# EAGLE design Schematic (EAGLE 9.6.2)

## Sheet 1 of 2
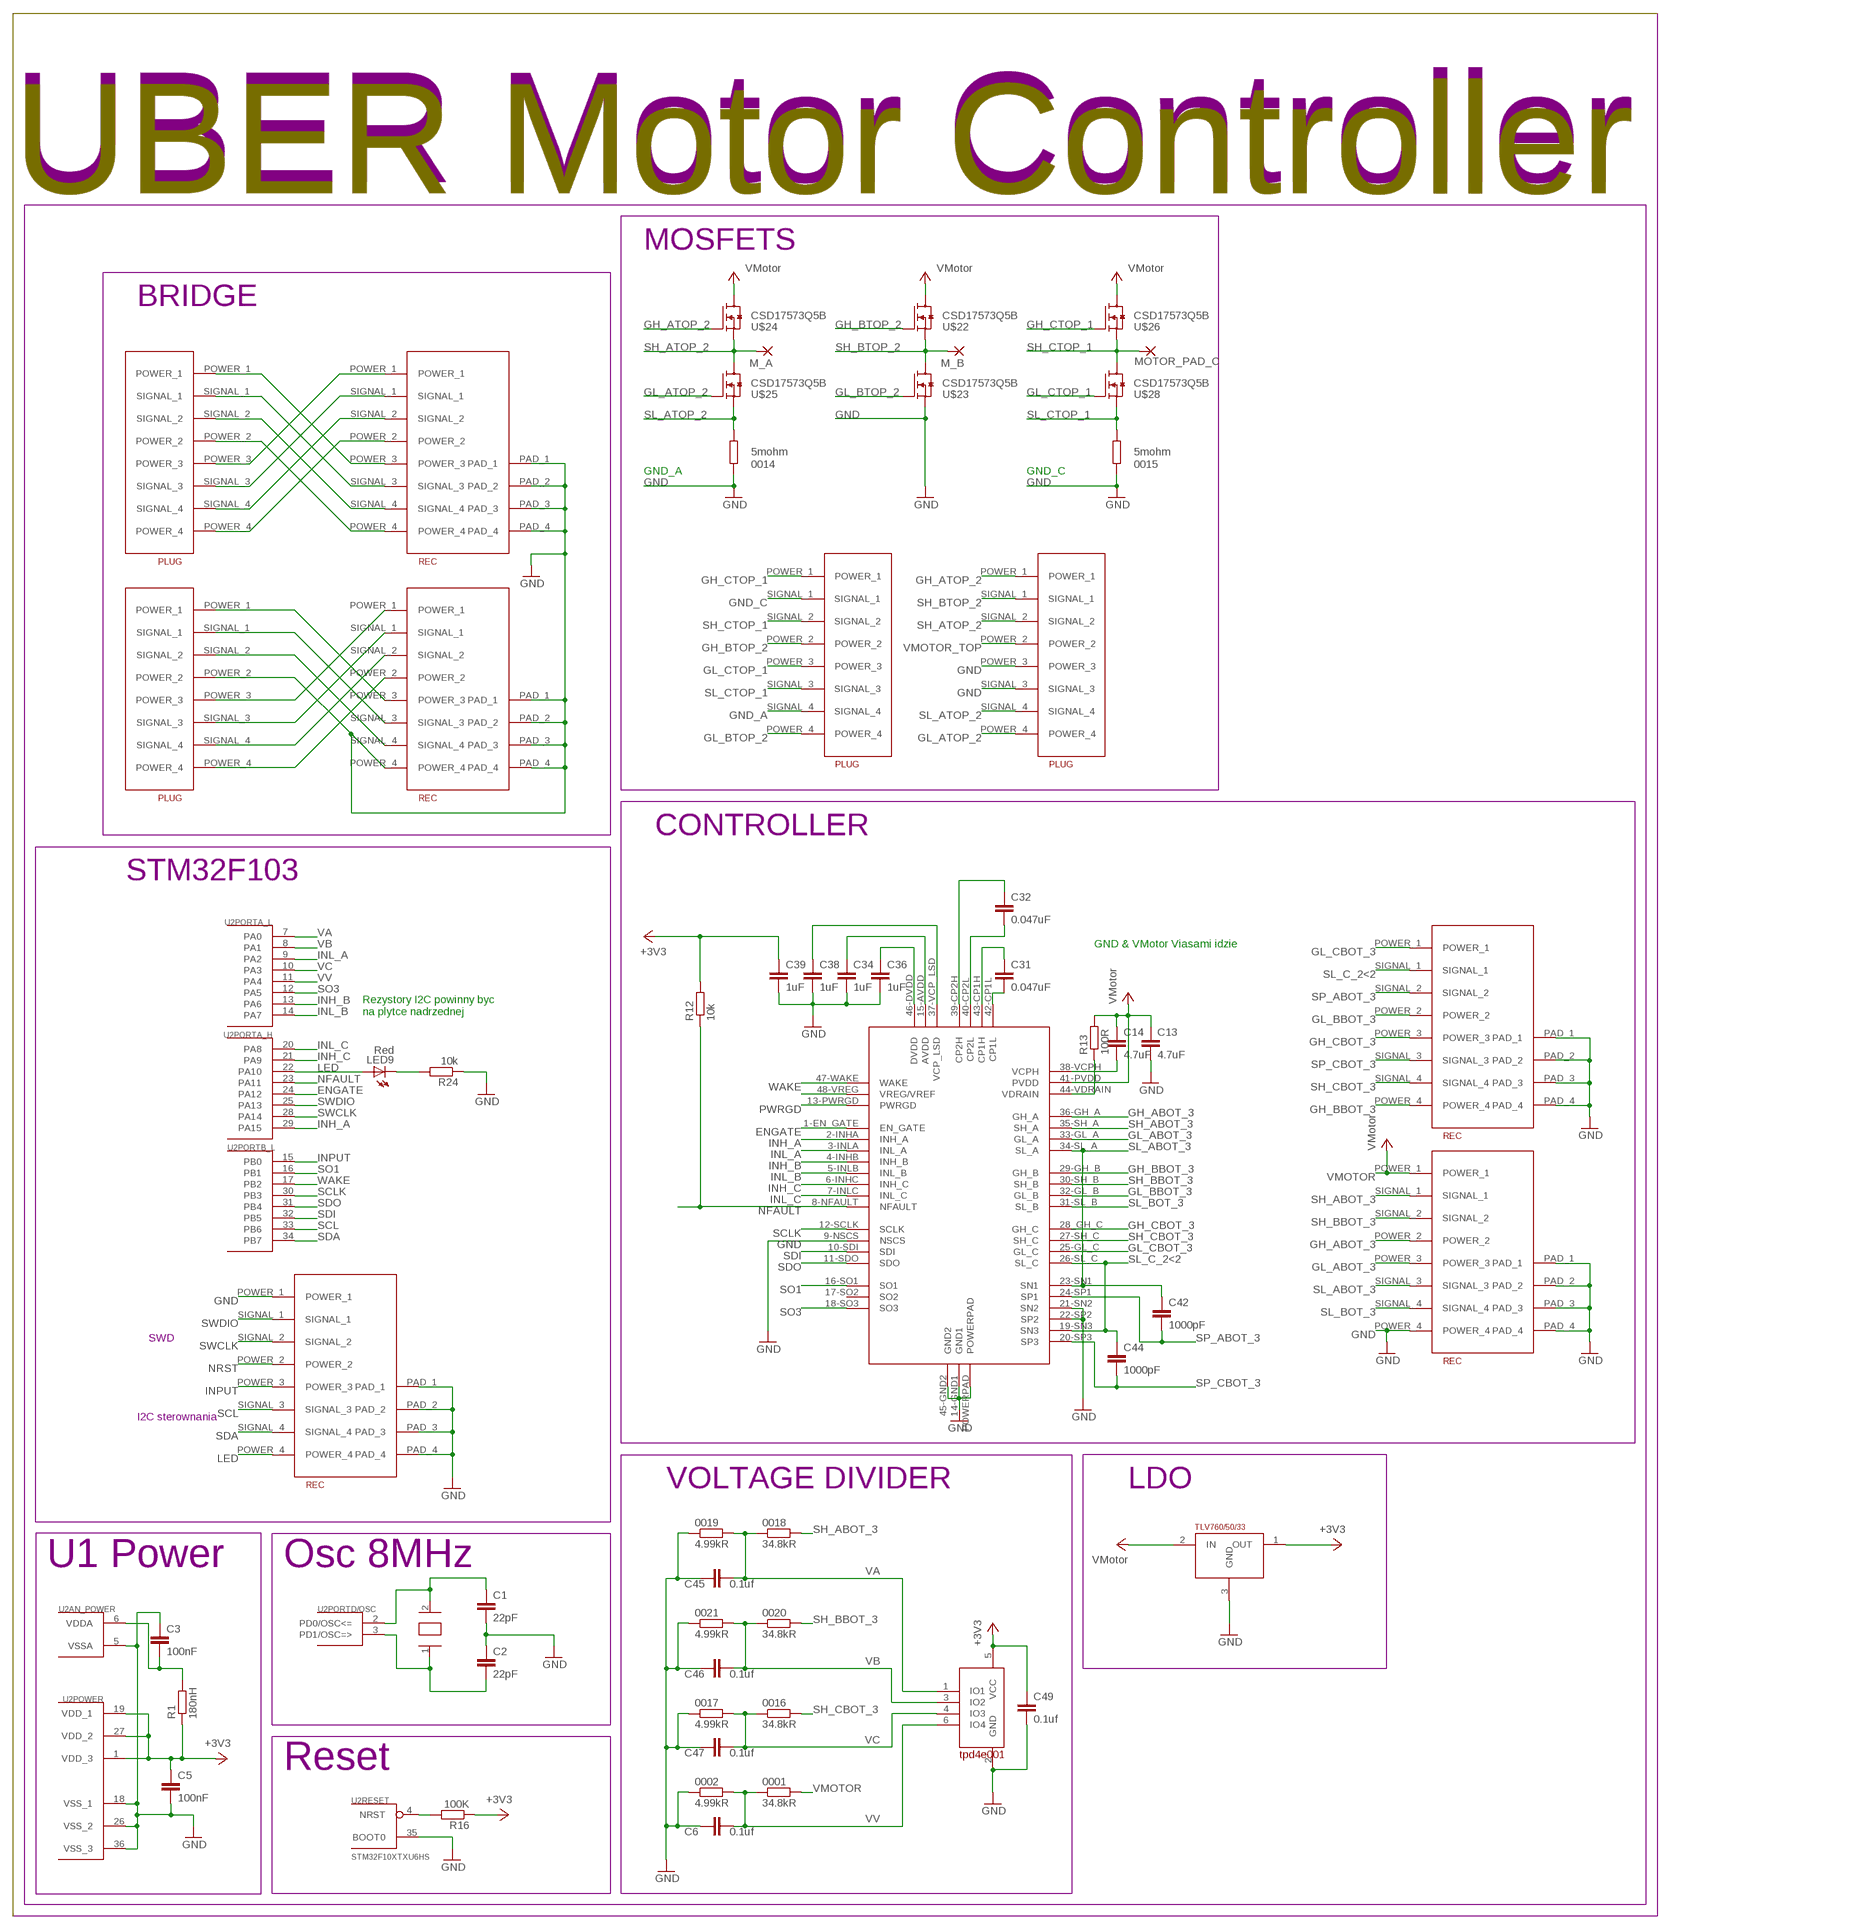
[diagram p0: schematic, sheet 1]

### Parts
0001  34.8kR  R-EU_R0603  [R0603]
0002  4.99kR  R-EU_R0603  [R0603]
0014  5mohm  R-EU_R2512  [R2512]
0015  5mohm  R-EU_R2512  [R2512]
0016  34.8kR  R-EU_R0603  [R0603]
0017  4.99kR  R-EU_R0603  [R0603]
0018  34.8kR  R-EU_R0603  [R0603]
0019  4.99kR  R-EU_R0603  [R0603]
0020  34.8kR  R-EU_R0603  [R0603]
0021  4.99kR  R-EU_R0603  [R0603]
C1  22pF  C-EUC0603  [C0603]
C2  22pF  C-EUC0603  [C0603]
C3  100nF  C-EUC0603  [C0603]
C5  100nF  C-EUC0603  [C0603]
C6  0.1uf  C-EUC0603  [C0603]
C13  4.7uF  C-EUC0805  [C0805]
C14  4.7uF  C-EUC0805  [C0805]
C31  0.047uF  C-EUC0603  [C0603]
C32  0.047uF  C-EUC0603  [C0603]
C34  1uF  C-EUC0603  [C0603]
C36  1uF  C-EUC0603  [C0603]
C38  1uF  C-EUC0603  [C0603]
C39  1uF  C-EUC0603  [C0603]
C42  1000pF  C-EUC0603  [C0603]
C44  1000pF  C-EUC0603  [C0603]
C45  0.1uf  C-EUC0603  [C0603]
C46  0.1uf  C-EUC0603  [C0603]
C47  0.1uf  C-EUC0603  [C0603]
C49  0.1uf  C-EUC0603  [C0603]
LED9  Red  LEDSML0603  [SML0603]
M_A  SMD5  [SMD2,54-5,08]
M_B  SMD5  [SMD2,54-5,08]
MOTOR_PAD_C  SMD5  [SMD2,54-5,08]
R1  180nH  R-EU_R0603  [R0603]
R12  10k  R-EU_R0603  [R0603]
R13  100R  R-EU_R0603  [R0603]
R16  100K  R-EU_R0603  [R0603]
R24  10k  R-EU_R0603  [R0603]
U2  STM32F10XTXU6HS  [VFQFPN36-HS]
U$1  MOLEG_REC_8X0.4MM  [REC]
U$2  MOLEG_REC_8X0.4MM  [REC]
U$3  MOLEX_PLUG_8X0.4MM  [PLUG]
U$4  MOLEG_REC_8X0.4MM  [REC]
U$5  MOLEG_REC_8X0.4MM  [REC]
U$6  MOLEX_PLUG_8X0.4MM  [PLUG]
U$7  MOLEX_PLUG_8X0.4MM  [PLUG]
U$8  MOLEX_PLUG_8X0.4MM  [PLUG]
U$9  MOLEG_REC_8X0.4MM  [REC]
U$10  OSC_8MHZ  [SMD_MINI]
U$11  TLV760XX  [SOT-23-3]
U$21  DRV8305  [S-PQFP-G48]
U$22  CSD17573Q5B  [Q5B]
U$23  CSD17573Q5B  [Q5B]
U$24  CSD17573Q5B  [Q5B]
U$25  CSD17573Q5B  [Q5B]
U$26  CSD17573Q5B  [Q5B]
U$28  CSD17573Q5B  [Q5B]
U$31  TPD4E001  [SOT-23]

### Nets
+3V3: C5.1 C39.1 C49.1 R1.1 R12.2 R16.1 U2.1(POWER:VDD_3) U2.19(POWER:VDD_1) U2.27(POWER:VDD_2) U$11.1(OUT) U$31.5(VCC)
ENGATE: U2.24(PORTA_H:PA12) U$21.1-EN_GATE(EN_GATE)
GH_ABOT_3: U$9.POWER_2 U$21.36-GH_A(GH_A)
GH_ATOP_2: U$3.POWER_1 U$24.G
GH_BBOT_3: U$4.POWER_4 U$21.29-GH_B(GH_B)
GH_BTOP_2: U$6.POWER_2 U$22.G
GH_CBOT_3: U$4.POWER_3 U$21.28_GH_C(GH_C)
GH_CTOP_1: U$6.POWER_1 U$26.G
GL_ABOT_3: U$9.POWER_3 U$21.33-GL_A(GL_A)
GL_ATOP_2: U$3.POWER_4 U$25.G
GL_BBOT_3: U$4.POWER_2 U$21.32-GL_B(GL_B)
GL_BTOP_2: U$6.POWER_4 U$23.G
GL_CBOT_3: U$4.POWER_1 U$21.25-GL_C(GL_C)
GL_CTOP_1: U$6.POWER_3 U$28.G
GND: 0002.1 0014.1 0015.1 0017.1 0019.1 0021.1 C1.2 C2.1 C3.1 C5.2 C6.2 C13.2 C34.2 C36.2 C38.2 C39.2 C45.2 C46.2 C47.2 C49.2 R24.1 U2.5(AN_POWER:VSSA) U2.18(POWER:VSS_1) U2.26(POWER:VSS_2) U2.35(RESET:BOOT0) U2.36(POWER:VSS_3) U$1.PAD_1 U$1.PAD_2 U$1.PAD_3 U$1.PAD_4 U$2.PAD_1 U$2.PAD_2 U$2.PAD_3 U$2.PAD_4 U$2.POWER_1 U$3.POWER_3 U$3.SIGNAL_3 U$4.PAD_1 U$4.PAD_2 U$4.PAD_3 U$4.PAD_4 U$5.PAD_1 U$5.PAD_2 U$5.PAD_3 U$5.PAD_4 U$5.POWER_4 U$8.POWER_2 U$9.PAD_1 U$9.PAD_2 U$9.PAD_3 U$9.PAD_4 U$9.POWER_4 U$11.3(GND) U$21.9-NSCS(NSCS) U$21.14-GND1(GND1) U$21.21-SN2(SN2) U$21.22-SP2(SP2) U$21.45-GND2(GND2) U$21.POWERPAD U$23.S1(S) U$23.S2(S) U$23.S3(S) U$31.2(GND)
GND_A: U$6.SIGNAL_4
GND_C: U$6.SIGNAL_1
INH_A: U2.29(PORTA_H:PA15) U$21.2-INHA(INH_A)
INH_B: U2.13(PORTA_L:PA6) U$21.4-INHB(INH_B)
INH_C: U2.21(PORTA_H:PA9) U$21.6-INHC(INH_C)
INL_A: U2.9(PORTA_L:PA2) U$21.3-INLA(INL_A)
INL_B: U2.14(PORTA_L:PA7) U$21.5-INLB(INL_B)
INL_C: U2.20(PORTA_H:PA8) U$21.7-INLC(INL_C)
INPUT: U2.15(PORTB_L:PB0) U$2.POWER_3
LED: LED9.A U2.22(PORTA_H:PA10) U$2.POWER_4
N$2: U$21.48-VREG(VREG/VREF)
N$3: U$5.POWER_3 U$8.POWER_1
N$4: U$5.SIGNAL_3 U$8.SIGNAL_1
N$5: U$5.SIGNAL_4 U$8.SIGNAL_2
N$7: U$1.POWER_3 U$7.POWER_1
N$8: U$1.SIGNAL_3 U$7.SIGNAL_1
N$9: U$1.SIGNAL_4 U$7.SIGNAL_2
N$10: C36.1 U$21.46-DVDD(DVDD)
N$11: U$1.POWER_4 U$7.POWER_2
N$12: C34.1 U$21.15-AVDD(AVDD)
N$13: C38.1 U$21.37-VCP_LSD(VCP_LSD)
N$14: C31.2 U$21.42-CP1L(CP1L)
N$15: U$5.POWER_1 U$8.POWER_3
N$16: C31.1 U$21.43-CP1H(CP1H)
N$17: U$5.SIGNAL_1 U$8.SIGNAL_3
N$18: U$5.SIGNAL_2 U$8.SIGNAL_4
N$19: U$5.POWER_2 U$8.POWER_4
N$20: C32.2 U$21.40-CP2L(CP2L)
N$21: C32.1 U$21.39-CP2H(CP2H)
N$22: R13.1 U$21.44-VDRAIN(VDRAIN)
N$23: C14.2 U$21.38-VCPH(VCPH)
N$24: C1.1 U2.2(PORTD/OSC:PD0/OSC<=) U$10.2
N$25: U$1.POWER_1 U$7.POWER_3
N$26: U$1.SIGNAL_1 U$7.SIGNAL_3
N$27: U$1.SIGNAL_2 U$7.SIGNAL_4
N$28: U$1.POWER_2 U$7.POWER_4
N$45: C3.2 R1.2 U2.6(AN_POWER:VDDA)
N$53: C2.2 U2.3(PORTD/OSC:PD1/OSC=>) U$10.1
N$81: LED9.C R24.2
NFAULT: R12.1 U2.23(PORTA_H:PA11) U$21.8-NFAULT(NFAULT)
NRST: R16.2 U2.4(RESET:NRST) U$2.POWER_2
PWRGD: U$21.13-PWRGD(PWRGD)
SCL: U2.33(PORTB_L:PB6) U$2.SIGNAL_3
SCLK: U2.30(PORTB_L:PB3) U$21.12-SCLK(SCLK)
SDA: U2.34(PORTB_L:PB7) U$2.SIGNAL_4
SDI: U2.32(PORTB_L:PB5) U$21.10-SDI(SDI)
SDO: U2.31(PORTB_L:PB4) U$21.11-SDO(SDO)
SH_ABOT_3: 0018.2 U$9.SIGNAL_1 U$21.35-SH_A(SH_A)
SH_ATOP_2: M_A.1(P) U$3.SIGNAL_2 U$24.S1(S) U$24.S2(S) U$24.S3(S) U$25.D1(D) U$25.D2(D) U$25.D3(D) U$25.D4(D) U$25.D5(D)
SH_BBOT_3: 0020.2 U$9.SIGNAL_2 U$21.30-SH_B(SH_B)
SH_BTOP_2: M_B.1(P) U$3.SIGNAL_1 U$22.S1(S) U$22.S2(S) U$22.S3(S) U$23.D1(D) U$23.D2(D) U$23.D3(D) U$23.D4(D) U$23.D5(D)
SH_CBOT_3: 0016.2 U$4.SIGNAL_4 U$21.27-SH_C(SH_C)
SH_CTOP_1: MOTOR_PAD_C.1(P) U$6.SIGNAL_2 U$26.S1(S) U$26.S2(S) U$26.S3(S) U$28.D1(D) U$28.D2(D) U$28.D3(D) U$28.D4(D) U$28.D5(D)
SL_ABOT_3: C42.1 U$9.SIGNAL_3 U$21.23-SN1(SN1) U$21.34-SL_A(SL_A)
SL_ATOP_2: 0014.2 U$3.SIGNAL_4 U$25.S1(S) U$25.S2(S) U$25.S3(S)
SL_BOT_3: U$9.SIGNAL_4 U$21.31-SL_B(SL_B)
SL_C_2<2: C44.1 U$4.SIGNAL_1 U$21.19-SN3(SN3) U$21.26-SL_C(SL_C)
SL_CTOP_1: 0015.2 U$6.SIGNAL_3 U$28.S1(S) U$28.S2(S) U$28.S3(S)
SO1: U2.16(PORTB_L:PB1) U$21.16-SO1(SO1)
SO3: U2.12(PORTA_L:PA5) U$21.18-SO3(SO3)
SP_ABOT_3: C42.2 U$4.SIGNAL_2 U$21.24-SP1(SP1)
SP_CBOT_3: C44.2 U$4.SIGNAL_3 U$21.20-SP3(SP3)
SWCLK: U2.28(PORTA_H:PA14) U$2.SIGNAL_2
SWDIO: U2.25(PORTA_H:PA13) U$2.SIGNAL_1
VA: 0018.1 0019.2 C45.1 U2.7(PORTA_L:PA0) U$31.1(IO1)
VB: 0020.1 0021.2 C46.1 U2.8(PORTA_L:PA1) U$31.3(IO2)
VC: 0016.1 0017.2 C47.1 U2.10(PORTA_L:PA3) U$31.4(IO3)
VMOTOR: 0001.2 C13.1 C14.1 R13.2 U$9.POWER_1 U$11.2(IN) U$21.41-PVDD(PVDD) ; supply symbol labelled VMotor
VMOTOR_TOP: U$3.POWER_2 U$22.D1(D) U$22.D2(D) U$22.D3(D) U$22.D4(D) U$22.D5(D) U$24.D1(D) U$24.D2(D) U$24.D3(D) U$24.D4(D) U$24.D5(D) U$26.D1(D) U$26.D2(D) U$26.D3(D) U$26.D4(D) U$26.D5(D) ; supply symbol labelled VMotor
VV: 0001.1 0002.2 C6.1 U2.11(PORTA_L:PA4) U$31.6(IO4)
WAKE: U2.17(PORTB_L:PB2) U$21.47-WAKE(WAKE)
Unconnected: U$21.17-SO2(SO2)

### Notes on the sheet
- UBER Motor Controller | UBER Motor Controller
- MOSFETS
- BRIDGE
- GND_A | GND_C
- CONTROLLER
- STM32F103
- GND & VMotor Viasami idzie
- Rezystory I2C powinny byc 
  na plytce nadrzednej
- SWD
- I2C sterownania
- VOLTAGE DIVIDER | LDO
- U1 Power | Osc 8MHz
- Reset

## Sheet 2 of 2
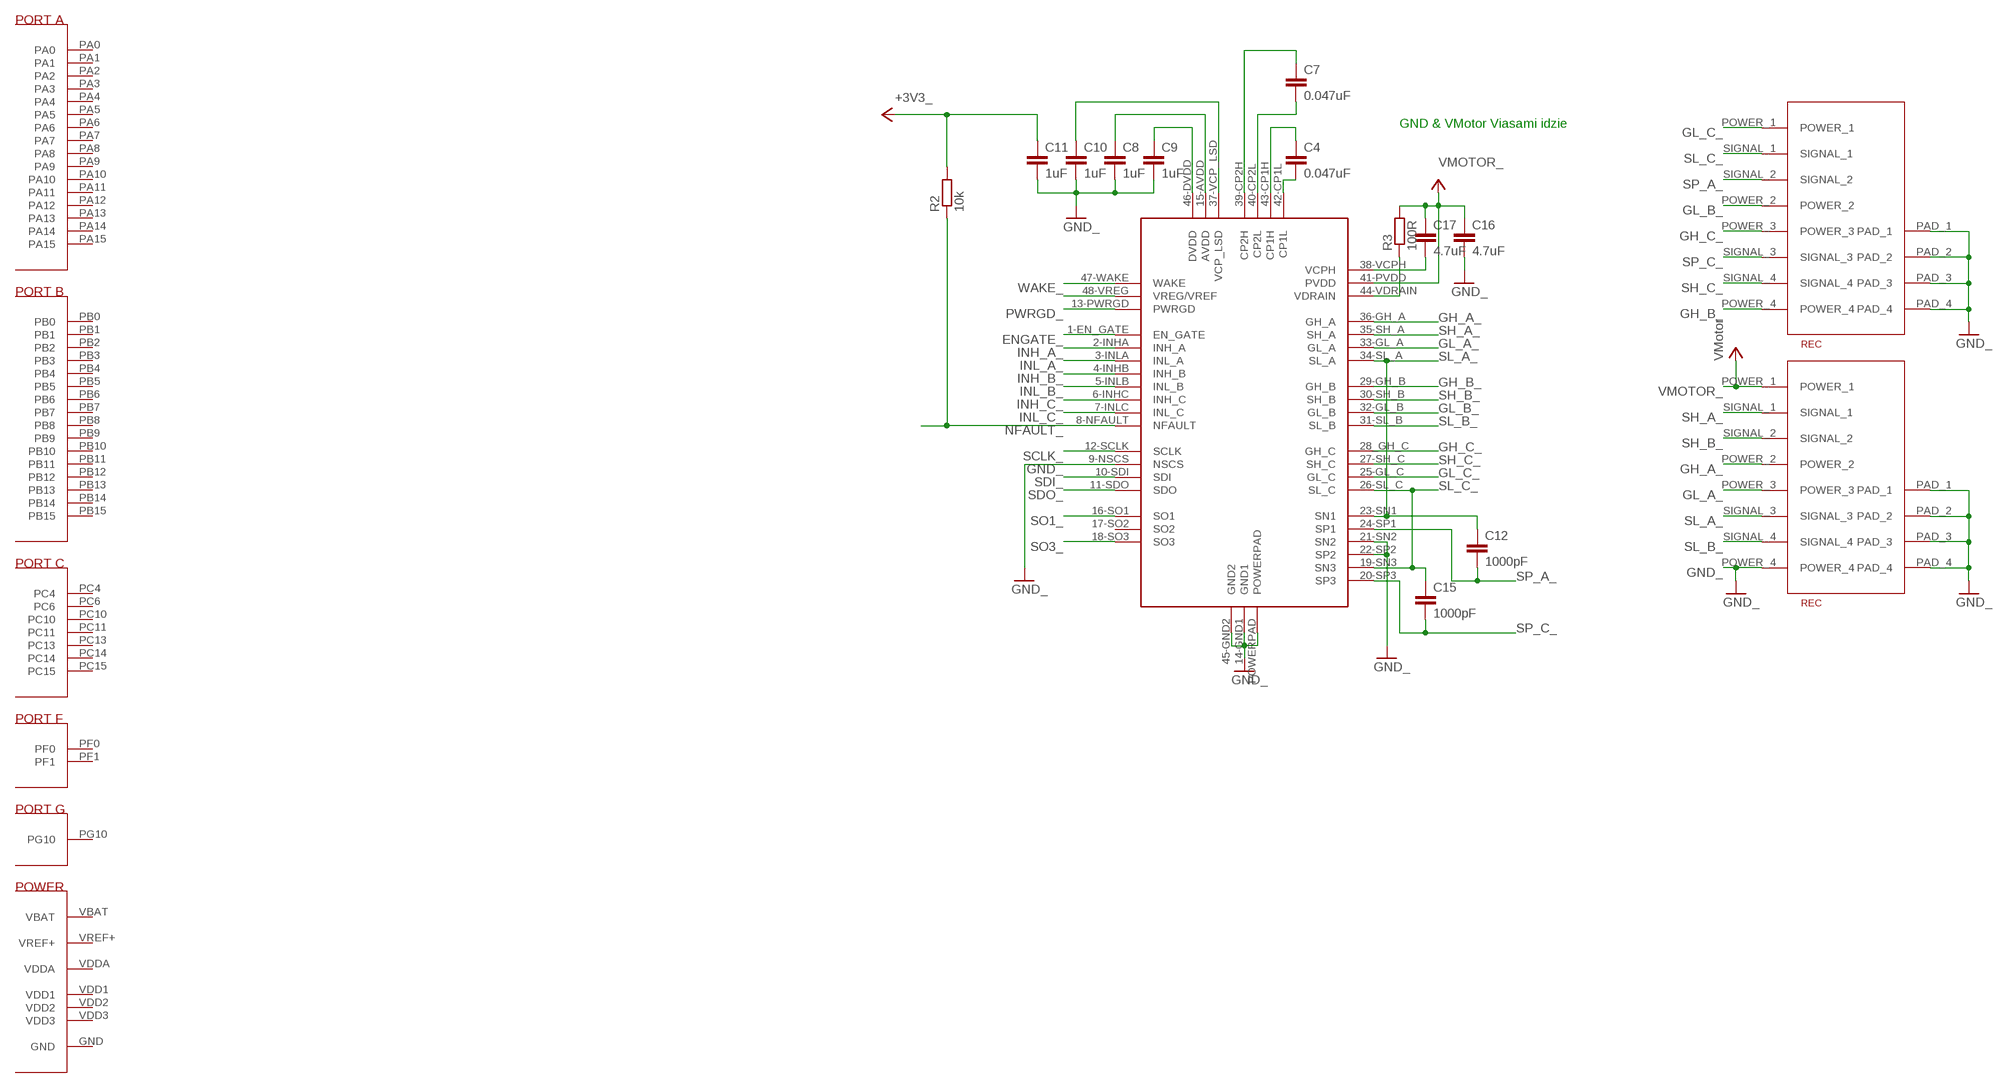
[diagram p1: schematic, sheet 2]

### Parts
C4  0.047uF  C-EUC0603  [C0603]
C7  0.047uF  C-EUC0603  [C0603]
C8  1uF  C-EUC0603  [C0603]
C9  1uF  C-EUC0603  [C0603]
C10  1uF  C-EUC0603  [C0603]
C11  1uF  C-EUC0603  [C0603]
C12  1000pF  C-EUC0603  [C0603]
C15  1000pF  C-EUC0603  [C0603]
C16  4.7uF  C-EUC0805  [C0805]
C17  4.7uF  C-EUC0805  [C0805]
R2  10k  R-EU_R0603  [R0603]
R3  100R  R-EU_R0603  [R0603]
U$12  STM32G473CC  [VFQFPN36]
U$13  DRV8305  [S-PQFP-G48]
U$14  MOLEG_REC_8X0.4MM  [REC]
U$15  MOLEG_REC_8X0.4MM  [REC]

### Nets
+3V3_: C11.1 R2.2 ; supply symbol labelled +3V3
ENGATE_: U$13.1-EN_GATE(EN_GATE)
GH_A_: U$13.36-GH_A(GH_A) U$15.POWER_2
GH_B_: U$13.29-GH_B(GH_B) U$14.POWER_4
GH_C_: U$13.28_GH_C(GH_C) U$14.POWER_3
GL_A_: U$13.33-GL_A(GL_A) U$15.POWER_3
GL_B_: U$13.32-GL_B(GL_B) U$14.POWER_2
GL_C_: U$13.25-GL_C(GL_C) U$14.POWER_1
GND_: C8.2 C9.2 C10.2 C11.2 C16.2 U$13.9-NSCS(NSCS) U$13.14-GND1(GND1) U$13.21-SN2(SN2) U$13.22-SP2(SP2) U$13.45-GND2(GND2) U$13.POWERPAD U$14.PAD_1 U$14.PAD_2 U$14.PAD_3 U$14.PAD_4 U$15.PAD_1 U$15.PAD_2 U$15.PAD_3 U$15.PAD_4 U$15.POWER_4 ; supply symbol labelled GND
INH_A_: U$13.2-INHA(INH_A)
INH_B_: U$13.4-INHB(INH_B)
INH_C_: U$13.6-INHC(INH_C)
INL_A_: U$13.3-INLA(INL_A)
INL_B_: U$13.5-INLB(INL_B)
INL_C_: U$13.7-INLC(INL_C)
N$30: C9.1 U$13.46-DVDD(DVDD)
N$31: C8.1 U$13.15-AVDD(AVDD)
N$32: C10.1 U$13.37-VCP_LSD(VCP_LSD)
N$33: C4.2 U$13.42-CP1L(CP1L)
N$34: C4.1 U$13.43-CP1H(CP1H)
N$35: C7.2 U$13.40-CP2L(CP2L)
N$36: C7.1 U$13.39-CP2H(CP2H)
N$38: R3.1 U$13.44-VDRAIN(VDRAIN)
N$39: C17.2 U$13.38-VCPH(VCPH)
N$40: U$13.48-VREG(VREG/VREF)
NFAULT_: R2.1 U$13.8-NFAULT(NFAULT)
PWRGD_: U$13.13-PWRGD(PWRGD)
SCLK_: U$13.12-SCLK(SCLK)
SDI_: U$13.10-SDI(SDI)
SDO_: U$13.11-SDO(SDO)
SH_A_: U$13.35-SH_A(SH_A) U$15.SIGNAL_1
SH_B_: U$13.30-SH_B(SH_B) U$15.SIGNAL_2
SH_C_: U$13.27-SH_C(SH_C) U$14.SIGNAL_4
SL_A_: C12.1 U$13.23-SN1(SN1) U$13.34-SL_A(SL_A) U$15.SIGNAL_3
SL_B_: U$13.31-SL_B(SL_B) U$15.SIGNAL_4
SL_C_: C15.1 U$13.19-SN3(SN3) U$13.26-SL_C(SL_C) U$14.SIGNAL_1
SO1_: U$13.16-SO1(SO1)
SO3_: U$13.18-SO3(SO3)
SP_A_: C12.2 U$13.24-SP1(SP1) U$14.SIGNAL_2
SP_C_: C15.2 U$13.20-SP3(SP3) U$14.SIGNAL_3
VMOTOR_: C16.1 C17.1 R3.2 U$13.41-PVDD(PVDD) U$15.POWER_1 ; supply symbol labelled VMotor
WAKE_: U$13.47-WAKE(WAKE)
Unconnected: U$12.GND U$12.PA0 U$12.PA1 U$12.PA2 U$12.PA3 U$12.PA4 U$12.PA5 U$12.PA6 U$12.PA7 U$12.PA8 U$12.PA9 U$12.PA10 U$12.PA11 U$12.PA12 U$12.PA13 U$12.PA14 U$12.PA15 U$12.PB0 U$12.PB1 U$12.PB2 U$12.PB3 U$12.PB4 U$12.PB5 U$12.PB6 U$12.PB7 U$12.PB8 U$12.PB9 U$12.PB10 U$12.PB11 U$12.PB12 U$12.PB13 U$12.PB14 U$12.PB15 U$12.PC4 U$12.PC6 U$12.PC10 U$12.PC11 U$12.PC13 U$12.PC14 U$12.PC15 U$12.PF0 U$12.PF1 U$12.PG10 U$12.VBAT U$12.VDD1 U$12.VDD2 U$12.VDD3 U$12.VDDA U$12.VREF+ U$13.17-SO2(SO2)

### Notes on the sheet
- GND & VMotor Viasami idzie

## Library data of the parts
0001 0002 0014-0021 R1-R3 R12 R13 R16 R24 = resistor:R-EU_: RESISTOR, European symbol
C1-C17 C31 C32 C34 C36 C38 C39 C42 C44-C47 C49 = rcl:C-EU: CAPACITOR, European symbol; SPICEPREFIX: C
LED9 = led:LED: LED OSRAM: - CHIPLED LG R971, LG N971, LY N971, LG Q971, LY Q971, LO R971, LY R971 LH N974, LH R974 LS Q976, LO Q976, LY Q976 LO Q996 - Hyper CHIPLED LW Q18S LB Q993, LB Q99A, LB R99A - SideLED LS A670, LO A670, LY A670, LG A670, LP A670 LB A673, LV A673, LT A673, LW A673 LH A674 LY A675 LS A676, LA A676, LO A676, LY A676, LW A676 LS A679, LY A679, LG A679 - Hyper Micro SIDELED® LS Y876, LA Y876, LO Y876, LY Y876 LT Y87S - SmartLED LW L88C, LW L88S LB L89C, LB L89S, LG L890 LS L89K, LO L89K, LY L89K LS L896, LA L896, LO L896, LY L896 - TOPLED LS T670, LO T670, LY T670, LG T670, LP T670 LSG T670, LSP T670, LSY T670, LOP T670, LYG T670 LG T671, LOG T671, LSG T671 LB T673, LV T673, LT T673, LW T673 LH T674 LS T676, LA T676, LO T676, LY T676, LB T676, LH T676, LSB T676, LW T676 LB T67C, LV T67C, LT T67C, LS T67K, LO T67K, LY T67K, LW E67C LS E67B, LA E67B, LO E67B, LY E67B, LB E67C, LV E67C, LT E67C LW T67C LS T679, LY T679, LG T679 LS T770, LO T770, LY T770, LG T770, LP T770 LB T773, LV T773, LT T773, LW T773 LH T774 LS E675, LA E675, LY E675, LS T675 LS T776, LA T776, LO T776, LY T776, LB T776 LHGB T686 LT T68C, LB T68C - Hyper Mini TOPLED® LB M676 - Mini TOPLED Santana® LG M470 LS M47K, LO M47K, LY M47K Source: http://www.osram.convergy.de LUXEON: - LUMILED® LXK2-PW12-R00, LXK2-PW12-S00, LXK2-PW14-U00, LXK2-PW14-V00 LXK2-PM12-R00, LXK2-PM12-S00, LXK2-PM14-U00 LXK2-PE12-Q00, LXK2-PE12-R00, LXK2-PE12-S00, LXK2-PE14-T00, LXK2-PE14-U00 LXK2-PB12-K00, LXK2-PB12-L00, LXK2-PB12-M00, LXK2-PB14-N00, LXK2-PB14-P00, LXK2-PB14-Q00 LXK2-PR12-L00, LXK2-PR12-M00, LXK2-PR14-Q00, LXK2-PR14-R00 LXK2-PD12-Q00, LXK2-PD12-R00, LXK2-PD12-S00 LXK2-PH12-R00, LXK2-PH12-S00 LXK2-PL12-P00, LXK2-PL12-Q00, LXK2-PL12-R00 Source: www.luxeon.com KINGBRIGHT: KA-3528ASYC Source: www.kingbright.com
M_A M_B MOTOR_PAD_C = wirepad:SMD5: SMD PAD
U2 = stm32:STM32F10XTXU6: STM32F101/103 36pad VFQPFN36
U$1 U$2 U$4 U$5 U$9 U$14 U$15 = MOLEX:MOLEG_REC_8X0.4MM
U$3 U$6-U$8 = MOLEX:MOLEX_PLUG_8X0.4MM
U$10 = OSC_8MHZ:OSC_8MHZ
U$11 = Zestaw:TLV760XX
U$12 = STM32G473CC:STM32G473CC
U$13 U$21 = drv8305lbr:DRV8305
U$22-U$26 U$28 = CSD_Mosfet:CSD17573Q5B
U$31 = tpd4e001:TPD4E001

## Board
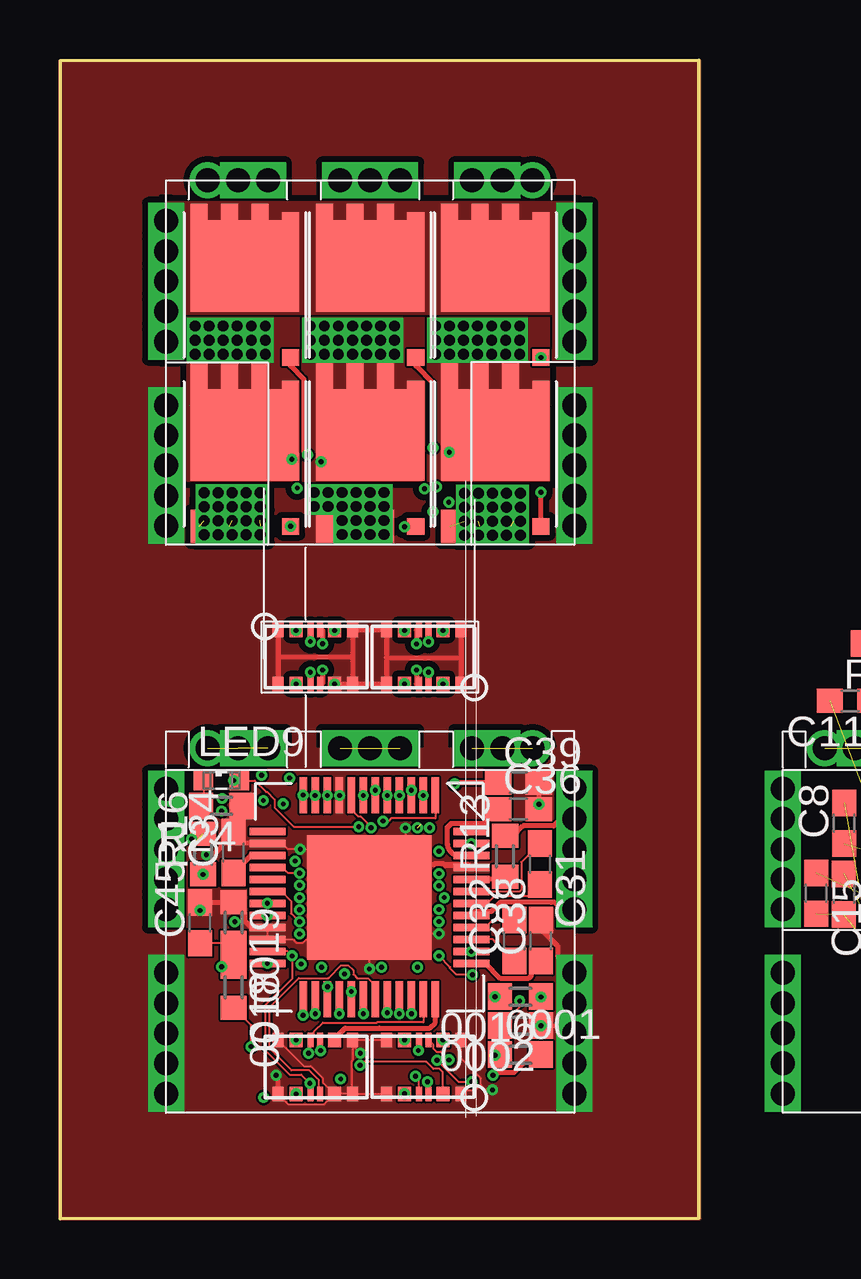
[diagram p2: board, top side]
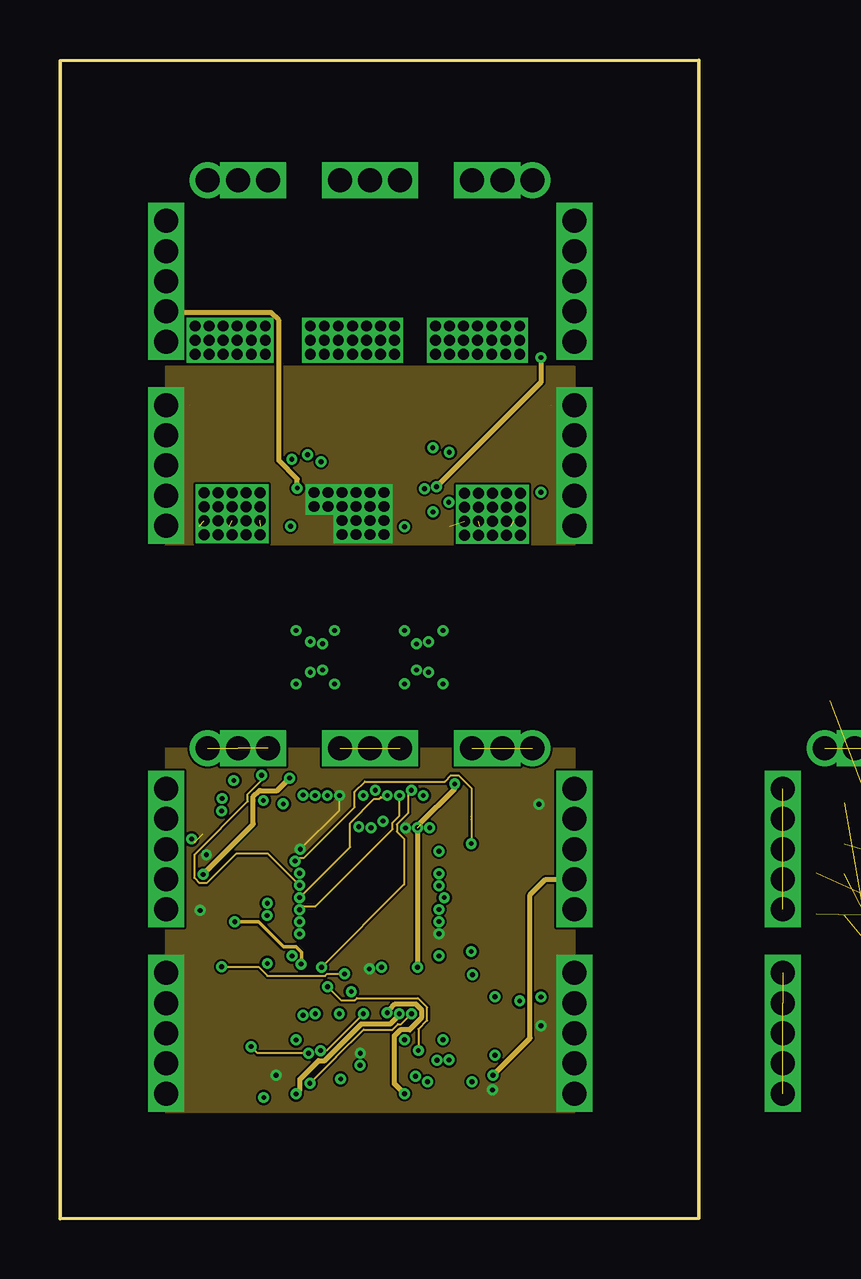
[diagram p3: board, inner layer Route2]
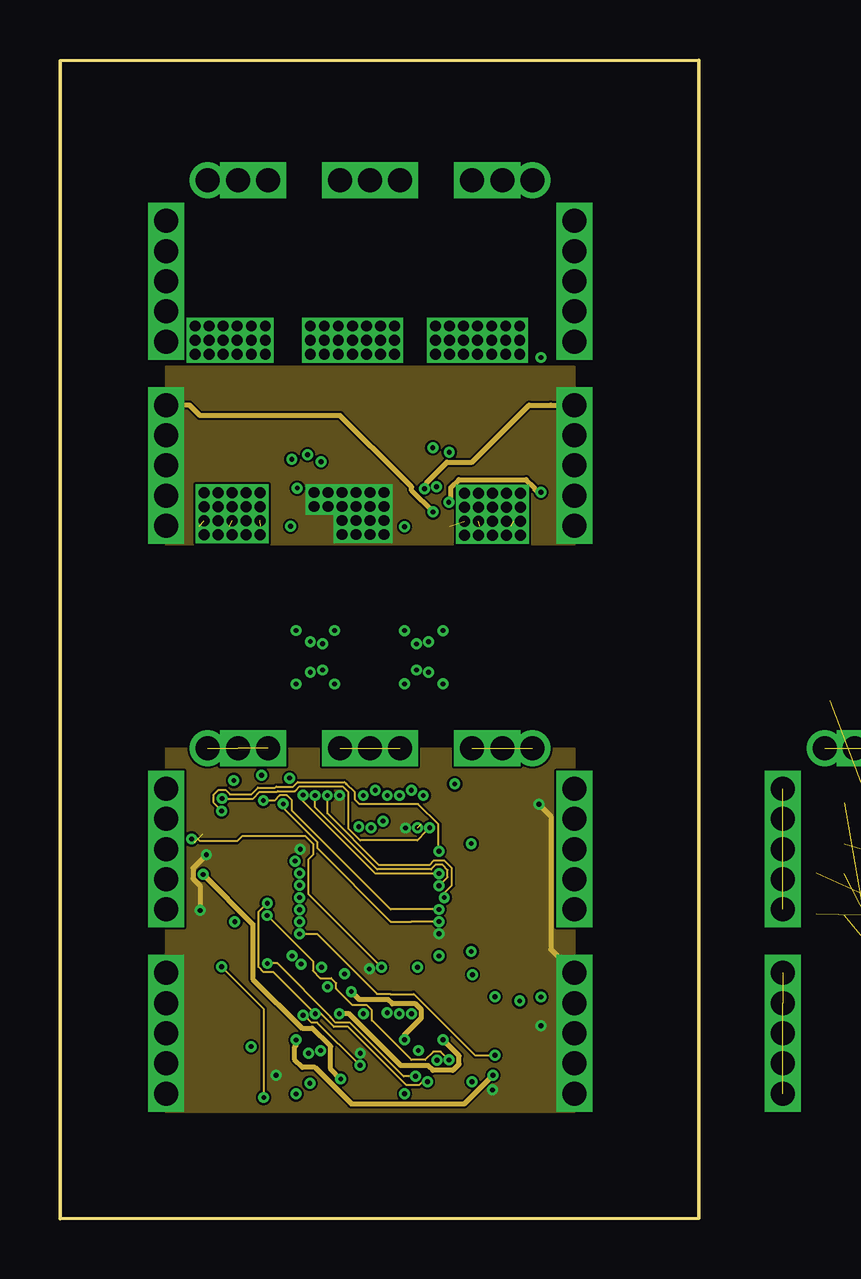
[diagram p4: board, inner layer Route15]
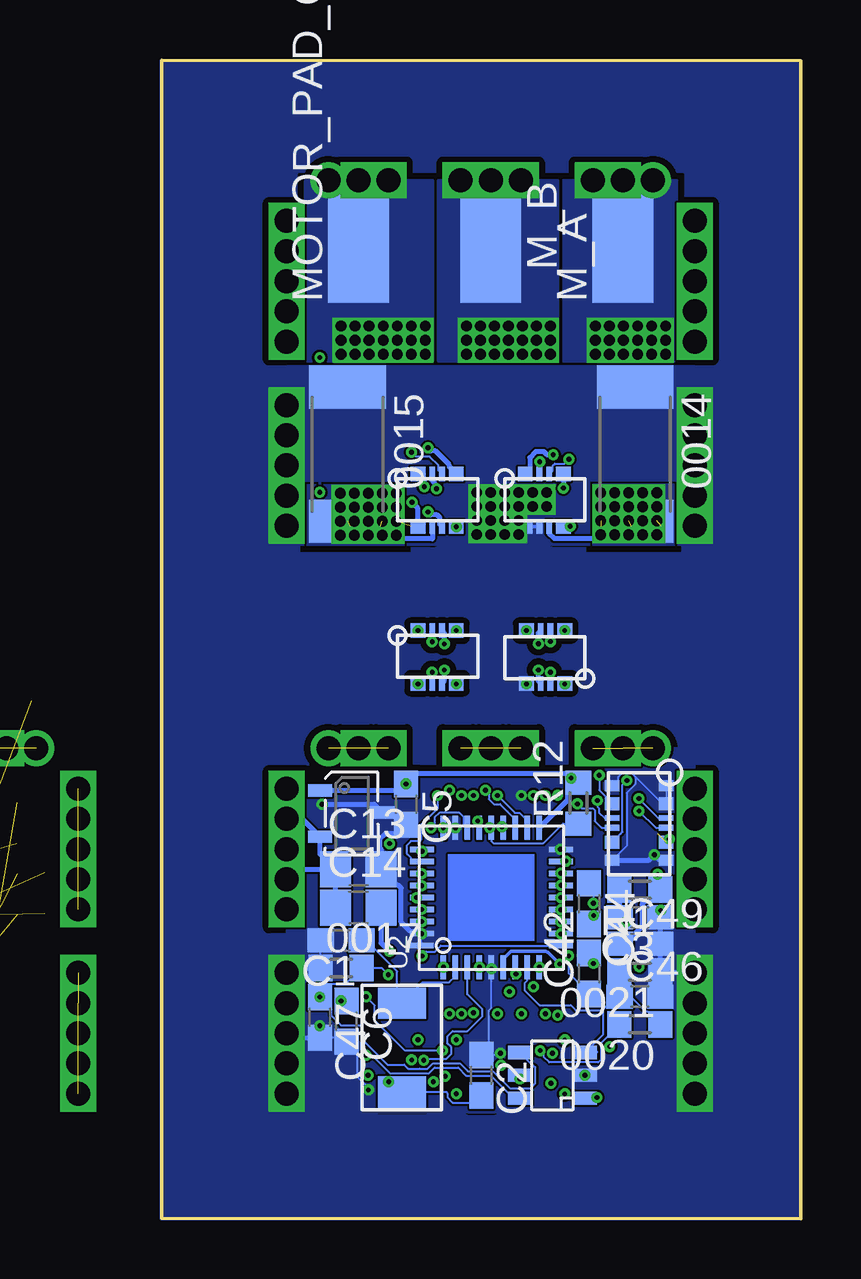
[diagram p5: board, bottom side, seen from below]

Size 26.64 x 48.29 mm. Coordinates in mm from the lower left corner, seen from the top.
Outline: 0,0 0,48.26 26.64,48.29 26.64,0.02 0,0
Copper layers (1*2*15*16): Top 0.035mm / dielectric 0.2mm / Route2 0.017mm / dielectric 0.2mm / Route15 0.017mm / dielectric 0.2mm / Bottom 0.035mm
Design rules "default *": minimum track width 3.5mil, minimum drill 0.3mm, track to track 3.5mil, track to pad 3.5mil, pad to pad 3.5mil, via to via 3.5mil, smd to smd 0mil, copper to edge 0mil, drill to drill 0mil, minimum pad ring 5mil, minimum via ring 5mil, stop-mask expansion 1mil, vias tented up to drill 0mil, thermal gap 0mil

### Footprints (pad centres in the part's own frame; a part is rotated, then mirrored left to right if it is on the bottom)
R0603 = smd 1 x 1.1: 1 -0.85,0; 2 0.85,0
R2512 = smd 1.8 x 3.2: 1 -2.8,0; 2 2.8,0
C0603 = smd 1.1 x 1: 1 -0.85,0; 2 0.85,0
C0805 = smd 1.3 x 1.5: 1 -0.95,0; 2 0.95,0
SML0603 = smd 0.8 x 0.8: A 0.75,0; C -0.75,0
SMD2,54-5,08 = smd 2.54 x 5.08: 1 0,0
VFQFPN36-HS = smd 1 x 0.23: 1 -2.9,2; 2 -2.9,1.5; 3 -2.9,1; 4 -2.9,0.5; 5 -2.9,0; 6 -2.9,-0.5; 7 -2.9,-1; 8 -2.9,-1.5; 9 -2.9,-2; 19 2.9,-2; 20 2.9,-1.5; 21 2.9,-1; 22 2.9,-0.5; 23 2.9,0; 24 2.9,0.5; 25 2.9,1; 26 2.9,1.5; 27 2.9,2 | smd 0.23 x 1: 10 -2,-2.9; 11 -1.5,-2.9; 12 -1,-2.9; 13 -0.5,-2.9; 14 0,-2.9; 15 0.5,-2.9; 16 1,-2.9; 17 1.5,-2.9; 18 2,-2.9; 28 2,2.9; 29 1.5,2.9; 30 1,2.9; 31 0.5,2.9; 32 0,2.9; 33 -0.5,2.9; 34 -1,2.9; 35 -1.5,2.9; 36 -2,2.905
REC = smd 0.45 x 0.6: PAD_1 -0.75,0; PAD_2 2.35,0; PAD_3 -0.75,-2.25; PAD_4 2.35,-2.25 | smd 0.55 x 0.6: POWER_1 0,0; POWER_2 1.6,0; POWER_3 0,-2.25; POWER_4 1.6,-2.25 | smd 0.24 x 0.6: SIGNAL_1 0.6,0; SIGNAL_2 1,0; SIGNAL_3 0.6,-2.25; SIGNAL_4 1,-2.25
PLUG = smd 0.62 x 0.6: POWER_1 0,0; POWER_2 1.6,0; POWER_3 0,-2.2; POWER_4 1.6,-2.2 | smd 0.24 x 0.6: SIGNAL_1 0.6,0; SIGNAL_2 1,0; SIGNAL_3 0.6,-2.2; SIGNAL_4 1,-2.2
SMD_MINI = smd 1.3 x 2: 1 -1.85,0; 2 1.85,0
SOT-23-3 = smd 0.508 x 1.016: 1 -0.941,-1.312; 2 0.986,-1.312; 3 -0.03,1.282
VFQFPN36 = smd 5.6 x 5.6: GND 0,0 | smd 0.55 x 0.3: PA0 -3.375,-0.775; PA1 -3.375,-1.275; PA2 -3.375,-1.775; PA3 -3.375,-2.275; PA4 -3.375,-2.775; PA8 3.375,-0.25; PA9 3.375,0.25; PA10 3.375,0.75; PA11 3.375,1.25; PA12 3.375,1.75; PA13 3.375,2.75; PB12 3.375,-2.75; PB13 3.375,-2.25; PB14 3.375,-1.75; PB15 3.375,-1.25; PC6 3.375,-0.75; PC13 -3.375,2.225; PC14 -3.375,1.725; PC15 -3.375,1.225; PF0 -3.375,0.725; PF1 -3.375,0.225; PG10 -3.375,-0.275; VBAT -3.375,2.725; VDD2 3.375,2.25 | smd 0.3 x 0.55: PA5 -2.75,-3.375; PA6 -2.25,-3.375; PA7 -1.75,-3.375; PA14 2.75,3.375; PA15 2.25,3.375; PB0 -0.75,-3.375; PB1 -0.25,-3.375; PB2 0.25,-3.375; PB3 0.75,3.375; PB4 0.25,3.375; PB5 -0.25,3.375; PB6 -0.75,3.375; PB7 -1.25,3.375; PB8 -1.75,3.375; PB9 -2.25,3.375; PB10 1.75,-3.375; PB11 2.75,-3.375; PC4 -1.25,-3.375; PC10 1.75,3.375; PC11 1.25,3.375; VDD1 -2.75,3.375; VDD3 2.25,-3.375; VDDA 1.25,-3.375; VREF+ 0.75,-3.375
S-PQFP-G48 = smd 0.3 x 1.5: 1-EN_GATE 0,0; 2-INHA 0.5,0; 3-INLA 1,0; 4-INHB 1.5,0; 5-INLB 2,0; 6-INHC 2.5,0; 7-INLC 3,0; 8-NFAULT 3.5,0; 9-NSCS 4,0; 10-SDI 4.5,0; 11-SDO 5,0; 12-SCLK 5.5,0; 25-GL_C 5.5,8.5; 26-SL_C 5,8.5; 27-SH_C 4.5,8.5; 28_GH_C 4,8.5; 29-GH_B 3.5,8.5; 30-SH_B 3,8.5; 31-SL_B 2.5,8.5; 32-GL_B 2,8.5; 33-GL_A 1.5,8.5; 34-SL_A 1,8.5; 35-SH_A 0.5,8.5; 36-GH_A 0,8.5 | smd 1.5 x 0.3: 13-PWRGD 7,1.5; 14-GND1 7,2; 15-AVDD 7,2.5; 16-SO1 7,3; 17-SO2 7,3.5; 18-SO3 7,4; 19-SN3 7,4.5; 20-SP3 7,5; 21-SN2 7,5.5; 22-SP2 7,6; 23-SN1 7,6.5; 24-SP1 7,7; 37-VCP_LSD -1.5,7; 38-VCPH -1.5,6.5; 39-CP2H -1.5,6; 40-CP2L -1.5,5.5; 41-PVDD -1.5,5; 42-CP1L -1.5,4.5; 43-CP1H -1.5,4; 44-VDRAIN -1.5,3.5; 45-GND2 -1.5,3; 46-DVDD -1.5,2.5; 47-WAKE -1.5,2; 48-VREG -1.5,1.5 | smd 5.17 x 5.17: POWERPAD 2.75,4.25
Q5B = smd 3.8 x 4.52: D1 0,-0.635 | smd 0.686 x 0.71: D2 -1.905,1.27; G 3.81,1.27 | smd 1.372 x 0.71: D3 -1.905,0; D4 -1.905,-1.27; D5 -1.905,-2.54; S1 3.81,0; S2 3.81,-1.27; S3 3.81,-2.54
SOT-23 = smd 0.55 x 1: 1 0,0; 2 0.95,0; 3 1.9,0; 4 1.9,2.7; 5 0.95,2.7; 6 0,2.7

### Placement (x,y rotation side)
0001  19.2,6.85 0 top
0002  19.2,8.05 180 top
0014  6.91,31.86 270 bottom
0015  18.9,31.86 270 bottom
0016  19.2,9.26 180 top
0017  19.16,10.45 0 bottom
0018  7.24,9.65 270 top
0019  7.24,12.34 270 top
0020  6.71,8.1 180 bottom
0021  6.71,10.3 180 bottom
C1  19.16,11.61 180 bottom
C2  13.32,5.98 270 bottom
C3  6.71,12.56 180 bottom
C4  44.2,16.46 270 top  (outside the outline)
C5  16.46,17.27 270 bottom
C6  18.95,8.23 270 bottom
C7  44.2,13.56 90 top  (outside the outline)
C8  32.69,16.48 90 top  (outside the outline)
C9  43.24,23.1 0 top  (outside the outline)
C10  49.24,10.17 270 top  (outside the outline)
C11  32.94,21.58 180 top  (outside the outline)
C12  32.68,13.53 270 top  (outside the outline)
C13  18.45,14.57 0 bottom
C14  18.45,12.97 0 bottom
C15  31.52,13.56 270 top  (outside the outline)
C16  45.54,16.93 90 top  (outside the outline)
C17  45.54,13.77 270 top  (outside the outline)
C31  20,14.78 270 top
C32  18.95,11.6 90 top
C34  7.24,15.27 90 top
C36  19.11,17.07 0 top
C38  20.05,11.6 90 top
C39  19.11,18.17 0 top
C42  8.83,10.22 90 bottom
C44  8.83,13.13 270 bottom
C45  5.84,12.33 90 top
C46  6.71,9.26 0 bottom
C47  20.05,8.39 270 bottom
C49  6.71,11.46 0 bottom
LED9  6.73,18.26 0 top
M_A  7.42,40.72 0 bottom
M_B  12.93,40.72 180 bottom
MOTOR_PAD_C  18.44,40.72 0 bottom
R1  6.71,13.72 180 bottom
R2  34.33,23.98 180 top  (outside the outline)
R3  48.98,21.01 90 top  (outside the outline)
R12  9.27,17.32 90 bottom
R13  18.55,15.11 90 top
R16  5.97,15.2 90 top
R24  6.73,17.21 180 top
U2  12.9,13.39 90 bottom
U$1  15.96,22.29 180 top
U$2  5.61,17.3 270 bottom
U$3  11.49,31.04 0 bottom
U$4  15.96,5.21 180 top
U$5  9.84,24.54 0 top
U$6  15.96,31.04 0 bottom
U$7  15.96,24.51 0 bottom
U$8  9.84,22.31 180 bottom
U$9  9.84,7.45 0 top
U$10  16.64,7.14 90 bottom
U$11  18.73,16.9 270 bottom
U$12  55.56,25.4 0 top  (outside the outline)
U$13  41.35,17.64 180 top  (outside the outline)
U$14  35.56,7.45 0 top  (outside the outline)
U$15  41.68,5.21 180 top  (outside the outline)
U$21  15.65,17.64 180 top
U$22  13.56,39.7 270 top
U$23  13.56,32.66 270 top
U$24  8.34,39.7 270 top
U$25  8.34,32.66 270 top
U$26  18.78,39.7 270 top
U$28  18.78,32.66 270 top
U$31  9,5.03 90 bottom

### Tracks (layer width: path | path; a pad name or v marks a point on that pad's centre or on a via)
+3V3  (via drill 0.2)  (1 unrouted)
  Top 0.203: C39.1 16.51,18.17 C5.1
  Route2 0.089: 15.05,16.44
  Route2 0.203: U2.1 v14.91,16.29 14.99,16.38 14.99,16.46 16.46,17.93 C5.1 | R16.1 8.06,16.45 8.06,17.6 8.31,17.85 8.35,17.85 9.06,17.85 v9.57,18.36
  Route15 0.203: v11.7,5.83 11.28,6.25 11.28,7.18 10.52,7.95 10.09,7.95 8.04,9.99 8.04,12.28 R16.1
  Bottom 0.089: U$31.5 v11.7,5.83 | U2.27 v14.91,16.29 | v14.91,16.29 | R1.1 5.86,14.24 R16.1
  Bottom 0.152: 10.86,16.29 U2.19
  Bottom 0.203: C5.1 16.32,18.26 16.32,18.27 | C5.1 16.52,18.07 | C5.1 16.46,18 | C5.1 16.74,17.84 U$11.1 | C5.1 16.01,18.57 9.68,18.57 9.54,18.43 9.53,18.43 R12.2 9.25,18.16 | U2.19 9.72,17.47 9.72,17.69 9.34,18.07 | 9.25,18.16 9.34,18.07 | R1.1 6.32,13.25 6.48,13.25 6.6,13.14 6.6,12.2 7.34,11.46 C49.1 | 8.98,18.48 8.98,18.43 9.25,18.16 | v9.57,18.36 9.57,18.3 9.34,18.07
  other vias: 14.9,10.49 16.46,18.12 5.97,14.35
+3V3_  (1 unrouted)
ENGATE  (via drill 0.2)
  Top 0.089: U$21.1-EN_GATE 15.65,16.69 13.8,16.69 13.69,16.57 v13.47,16.57
  Bottom 0.089: U2.24 | U2.24 13.4,16.5 v13.47,16.57
GH_A_  (1 unrouted)
GH_ABOT_3
  Top 0.203: U$9.POWER_2 11.44,7.5 11.89,7.95 13.31,7.95 15.41,7.95 15.65,8.18 U$21.36-GH_A
GH_ATOP_2  (via drill 0.2)
  Top 0.203: U$24.G 9.61,35.54 10.16,34.99 10.16,32 v10.32,31.83
  Bottom 0.203: v10.32,31.83 10.58,31.83 10.71,31.96 11.06,31.96 11.3,31.72 11.3,31.23 U$3.POWER_1
GH_B_  (1 unrouted)
GH_BBOT_3  (via drill 0.2)
  Top 0.203: v12.15,9.47 U$21.29-GH_B
  Route15 0.203: U$4.POWER_4 14.36,7.66 15.07,8.37 15.07,8.72 14.83,8.96 13.86,8.96 13.68,9.14 12.48,9.14 v12.15,9.47
  other vias: 14.36,7.46
GH_BTOP_2  (via drill 0.2)
  Top 0.203: U$22.G 14.83,35.54 15.54,34.83 v15.54,32.12
  Bottom 0.203: v15.54,32.12 15.42,32 15.23,32 14.65,31.42 14.65,31.33 U$6.POWER_2
GH_C_  (1 unrouted)
GH_CBOT_3  (via drill 0.2)
  Top 0.203: U$21.28_GH_C v11.65,8.54 | v11.65,8.54
  Route15 0.203: v11.65,8.54 12.06,8.54 14.21,6.39 15.35,6.39 15.54,6.19 16.38,6.19 16.64,6.45 16.64,6.79 15.98,7.46 U$4.POWER_3
  other vias: 15.96,7.46
GH_CTOP_1  (via drill 0.2)
  Route2 0.203: U$26.G 20.05,34.86 v15.7,30.51
  Bottom 0.203: v15.7,30.51 15.7,30.77 U$6.POWER_1
  other vias: 20.05,35.89
GL_A_  (1 unrouted)
GL_ABOT_3  (via drill 0.2)
  Top 0.203: U$21.33-GL_A v14.15,8.54
  Route2 0.203: 14.15,8.5 v14.15,8.54 14.06,8.46 14.06,8.41 13.78,8.12 12.56,8.12 11.28,6.84 11.04,6.59 10.77,6.59 10,5.82 10,5.37 U$9.POWER_3
  other vias: 9.84,5.2
GL_ATOP_2  (via drill 0.2)
  Bottom 0.203: U$3.POWER_4 9.88,28.85 U$25.G
  other vias: 9.61,28.85
GL_B_  (1 unrouted)
GL_BBOT_3  (via drill 0.2)
  Top 0.203: U$21.32-GL_B v13.65,8.59 v13.64,8.58
  Route2 0.203: v13.64,8.58 13.73,8.67 13.73,8.72 13.97,8.96 14.83,8.96 15.07,8.72 15.07,8.37 14.57,7.87 14.19,7.87 13.95,7.63 13.95,5.62 U$4.POWER_2
  other vias: 14.36,5.21
GL_BTOP_2  (via drill 0.2)
  Top 0.203: U$6.POWER_4 14.38,28.85 U$23.G
  other vias: 14.36,28.84
GL_C_  (1 unrouted)
GL_CBOT_3  (via drill 0.2)
  Top 0.089: U$21.25-GL_C 10.13,9.12 10.14,9.12 v10.14,8.48 | U$4.POWER_1 15.96,6.11 15.83,6.25 15.57,6.25 15.28,6.54 12.65,6.54 v12.51,6.4
  Route15 0.089: v10.14,8.48 10.19,8.48 10.49,8.18 10.72,8.18 v12.51,6.4
GL_CTOP_1  (via drill 0.2)
  Top 0.203: U$28.G v20.05,30.28
  Route15 0.203: v20.05,30.28 19.99,30.22 19.77,30.45 19.77,30.47 19.44,30.8 16.63,30.8 16.3,30.47 16.3,29.94 v16.21,29.86
  Bottom 0.203: U$6.POWER_3 15.96,29.61 v16.21,29.86
GND  (via drill 0.2, 0.45, 1)
  Top 0.089: v15.8,11.88 15.31,11.88 15.14,12.05 13.74,12.05 13.58,12.22 | U$21.POWERPAD 12.9,12.9 13.58,12.22 | v12.9,10.41 12.9,11.65 | 12.9,11.65 12.9,11.71 12.99,11.8 13.16,11.8 13.58,12.22 | U$21.45-GND2 16.98,14.64 16.06,14.64 15.95,14.75 15.15,14.75 14.28,14.75 12.92,13.39 U$21.POWERPAD | U$21.14-GND1 8.68,15.67 8.72,15.67 9.23,15.67 9.5,15.4 v10.02,15.4 11.26,15.4 11.3,15.44 12.9,13.85 U$21.POWERPAD | U$21.9-NSCS | U2.26 14.4,15.6 12.9,14.09 12.9,13.02 | U$21.21-SN2 U$21.22-SP2 9.72,11.64 9.85,11.51 10.14,11.51 10.28,11.65 12.9,11.65 | 12.22,7.46 U$9.PAD_2 12.19,6.6 12.15,6.55 12.15,5.23 12.12,5.21 | 12.22,7.46 U$4.PAD_4 | U$4.PAD_2 U$9.PAD_4 12.12,5.21 | 12.12,5.21 U$9.POWER_4 | U$9.POWER_4 | U$9.PAD_3 9.43,4.86 9.43,4.85 9.51,4.77 11.02,4.77 U$9.POWER_4 | 17.54,5.56 17.33,5.35 16.86,5.35 U$4.PAD_1 | 17.54,5.56 17.54,5.86 16.71,6.69 U$4.PAD_3 | U$9.PAD_1 9.43,7.11 9.43,7.1 10.17,6.37 10.46,6.37 10.96,5.87 10.96,5.7 U$9.POWER_4 | 12.15,7.38 12.22,7.46 | v12.52,6.9 12.22,7.21 12.22,7.46 | 0002.1 20.2,8.2 | v18.03,5.37 17.73,5.37 17.54,5.56
  Top 0.203: U$5.PAD_1 9.09,23.41 | 9.09,23.41 U$5.PAD_3 | 12.19,23.41 U$5.PAD_2 U$1.PAD_4 13.61,23.38 | 12.19,23.41 U$5.PAD_4 | 12.19,23.41 9.09,23.41 | U$5.PAD_4 U$1.PAD_2 13.61,23.38 | U$1.PAD_3 16.71,23.38 | 16.71,23.38 U$1.PAD_1 | 13.61,23.38 16.71,23.38 | U$5.POWER_4 U$5.PAD_4 | C39.2 v19.96,17.27 C36.2 | 16.48,14.64 16.98,14.64 | U$21.45-GND2 17.04,14.75 16.03,14.75 15.98,14.8 15.63,14.8 15.57,14.75 15.15,14.75 | 20.48,12.01 C38.2 20.05,12.06 20.74,11.37 20.74,10.94 v21.44,10.25 | v5.84,12.85 C45.2 5.86,13.19 0019.1 7.71,12.73 7.71,12.41 7.98,12.14 U$21.21-SN2 | C34.2 6.71,15.59 6.71,15.47 6.4,15.17 v6.11,15.17 | C34.2 7.58,16.46 R24.1 | C34.2 7.68,15.67 8.72,15.67 | U$9.PAD_3 9.09,5.89 U$31.2 | 0002.1 21.12,8.05 v21.44,7.73
  Top 0.61: 13.55,29.17 U$23.S1 13.51,28.82 | 13.55,28.65 13.55,28.55 v13.51,28.51
  Route2 0.089: v10.02,15.4 11.65,17.03 U$21.9-NSCS
  Route15 0.203: v19.96,17.27 20.46,16.78 20.46,11.23 v21.44,10.25 | v5.84,12.85 5.84,13.89 5.55,14.18 5.55,14.61 v6.11,15.17
  Bottom 0.089: U2.36 15.81,11.66 | 15.81,11.66 v15.81,11.88 U2.35 | 15.81,11.66 15.8,11.66 v15.8,11.88 | v12.9,10.41 U2.5 12.9,8.8 13.01,8.69 13.01,7.14 C2.1 12.59,6.83 v12.52,6.9 | U2.18 v10.02,15.4 | 17.73,16.93 U$11.3 | C1.2 20.03,11.62 | 20.03,11.62 20.42,12.01 | 20.03,11.62 20.03,10.46 0017.1 20.31,10.74 | 0002.1 C47.2 19.11,7.54 C6.2 18.49,6.92 18.49,5.92 18.03,5.45 v18.03,5.37 | U$2.PAD_1 U$2.POWER_1 5.77,17.3 6.89,18.41 | 6.89,18.41 7.1,18.62 7.4,18.62 7.61,18.41 7.61,18.3 U$2.PAD_3 | 6.89,18.41 6.89,18.11 7.25,17.75 7.25,15.54 7.62,15.18 7.62,14.95
  Bottom 0.152: U$3.SIGNAL_3 U$3.POWER_3
  Bottom 0.203: U$8.POWER_2 U$5.POWER_4 | 16.82,16.31 16.76,16.33 16.67,16.42 C5.2 | v19.96,17.27 17.79,17.27 U$11.3 16.97,16.93 C5.2 | 16.76,16.9 16.76,16.73 C5.2 | U2.35 15.89,11.97 16.27,11.97 16.66,12.36 16.66,13.8 16.77,13.91 16.84,13.91 C13.2 17.5,15.4 17.56,15.46 17.56,15.81 17.32,16.05 16.83,16.05 C5.2 | C46.2 5.86,10.2 | 5.86,10.2 0021.1 C49.2 C3.1 5.86,12.84 v5.84,12.85 | U$2.PAD_2 5.88,14.95 v6.11,15.17 6.33,14.95 7.62,14.95 U$2.PAD_4 | v4.42,5.22 v4.42,6.48 v4.42,7.73 v4.42,8.99 v4.42,10.25 5.8,10.25 5.86,10.2 | v21.44,5.22 v21.44,6.48 v21.44,7.73 | v21.44,7.73 v21.44,8.99 v21.44,10.25 21.23,10.45 0017.1 | v21.44,7.73 21.25,7.54 C47.2
  other vias: 11.65,17.64 14.4,16.29 11.44,22.29 4.42,32.65 4.42,31.39 4.42,30.14 21.44,32.65 21.44,31.39 21.44,30.14 21.44,28.88 12.34,28.51 12.34,29.1 12.93,29.1 13.51,29.1 12.34,29.68 12.93,29.68 13.51,29.68 12.34,30.26 12.93,30.26 13.51,30.26 11.76,28.51 11.76,29.1 11.76,29.68 11.76,30.26 12.93,28.51 20.05,8.05 4.42,28.88 21.44,33.91 4.42,33.91 11.18,29.68 11.18,30.26 10.59,29.68 10.59,30.26 9,5.98
  pour Bottom (rank 2, no thermals): 4.42,28.08 4.42,35.52 21.44,35.52 21.44,28.08
  pour Route2 (no thermals): 4.42,35.52 21.44,35.52 21.44,28.08 4.42,28.08
  pour Route15 (no thermals): 4.42,35.52 21.44,35.52 21.44,28.08 4.42,28.08
  pour Top (no thermals): 4.42,4.43 4.42,19.61 8.66,19.61 21.44,19.61 21.44,4.98 21.44,4.43
  pour Route2 (no thermals): 4.42,4.43 4.42,19.61 18.44,19.61 21.44,19.61 21.44,5.03 21.44,4.43
  pour Route15 (no thermals): 4.42,4.43 4.42,19.61 18.71,19.61 21.44,19.61 21.44,4.56 21.44,4.43
  pour Bottom (no thermals): 4.42,4.43 4.42,19.61 18.68,19.61 21.44,19.61 21.44,5 21.44,4.43
  pour Top (isolate 0.254, rank 6): 0,48.26 0,0 26.67,0 26.67,48.26
  pour Bottom (isolate 0.254, rank 6): 0,48.26 26.67,48.26 26.67,0 0,0
GND1  (via drill 1)  (4 unrouted)
  other vias: 47.16,8.99 47.16,7.73 47.16,6.48 47.16,5.22 47.16,10.25
GND2  (via drill 1)  (4 unrouted)
  other vias: 30.14,8.99 30.14,7.73 30.14,6.48 30.14,5.22 30.14,10.25
GND_  (19 unrouted)
GND_A  (via drill 0.2)  (1 unrouted)
  Route15 0.203: 14.66,30.5 | 14.66,30.5 14.33,30.83 14.32,30.83 11.68,33.46 5.84,33.46 5.4,33.91 4.43,33.91 | v15.55,29.45 14.66,30.34 14.66,30.5
  Bottom 0.089: U$6.SIGNAL_4
  Bottom 0.203: U$6.SIGNAL_4 15.05,28.93 15.05,29.22 15.16,29.33 15.42,29.33 v15.55,29.45
GND_C  (via drill 0.2)  (1 unrouted)
  Route15 0.203: v15.19,30.42 15.28,30.51 15.28,30.68 16.13,31.53 17.18,31.53 19.56,33.91 20.46,33.91 | 20.46,33.91 21.43,33.91
  Bottom 0.203: U$6.SIGNAL_1 15.36,30.76 15.28,30.68 15.28,30.51 v15.19,30.42
INH_A  (via drill 0.2)
  Bottom 0.089: 15.37,14.89 U2.29 16.11,14.89 16.4,15.18 16.44,15.22 16.44,15.56 16.25,15.74 15.9,15.74 15.83,15.82 15.83,16.42 15.15,17.1 U$21.2-INHA
  other vias: 15.15,17.64
INH_B  (via drill 0.2)
  Top 0.089: U$21.4-INHB
  Route2 0.089: v10,12.88 10.14,13.03 10.65,13.03 13.87,16.24 13.87,16.51 14.15,16.8 U$21.4-INHB
  Bottom 0.089: U2.13 v10,12.88
  other vias: 14.15,17.64
INH_C  (via drill 0.2)
  Top 0.089: U$21.6-INHC v13.15,17.85
  Bottom 0.089: v13.15,17.85 13.01,17.71 13.01,17.49 12.8,17.28 12.54,17.28 12.23,16.97 12,16.74 11.91,16.74 11.9,16.73 U2.21
INL_A  (via drill 0.2)
  Top 0.089: v14.65,17.86 U$21.3-INLA
  Route2 0.089: v14.65,17.86 14.51,17.72 14.51,16.9 14.04,16.43 14.04,16.14 14.35,15.83 14.35,13.94 U2.9
  Bottom 0.089: U2.9
  other vias: 10.9,10.49
INL_B  (via drill 0.2)
  Route2 0.089: 13.65,17.54 13.65,17.58 | 13.65,17.58 U$21.5-INLB | U2.14 12.1,15.49 12.1,16.49 13.1,17.49 13.3,17.49 13.38,17.58 13.65,17.58
  Bottom 0.089: U2.14
  other vias: 10,13.39 13.65,17.64
INL_C  (via drill 0.2)
  Bottom 0.089: U$21.7-INLC 11.92,16.92 11.73,16.92 11.4,16.59 U2.20
  other vias: 12.65,17.64
INPUT  (via drill 0.2)
  Route2 0.089: v9.99,13.89 8.67,15.22 7.35,15.22 6.12,13.99 5.82,13.99 5.61,14.2 5.61,15.18 7.83,17.4 7.83,17.7 8.4,18.28 v8.4,18.48
  Bottom 0.089: v9.99,13.89 U2.15 | U$2.POWER_3 8.12,17.55 8.12,17.58 8.4,17.86 v8.4,18.48
LED  (via drill 0.2)
  Top 0.089: v7.25,18.26 LED9.A 8.12,18.26 8.59,17.79 8.63,17.79 8.95,17.47 8.95,17.14 9.75,16.34 v12.46,16.34
  Bottom 0.089: 12.37,16.57 12.4,16.54 U2.22 v12.46,16.34 | U$2.POWER_4 7.52,16.04 7.51,16.04 7.43,16.12 7.43,18.08 v7.25,18.26
N$1  (via drill 1)  (2 unrouted)
  other vias: 31.88,19.61 33.13,19.61 34.39,19.61
N$3  (via drill 0.2)
  Bottom 0.203: U$5.POWER_3 U$8.POWER_1
  other vias: 9.84,22.29
N$4  (via drill 0.2)
  Top 0.203: U$5.SIGNAL_3 v10.44,22.78
  Bottom 0.203: v10.44,22.78 U$8.SIGNAL_1
N$5  (via drill 0.2)
  Top 0.203: v10.94,22.87 10.94,22.29 U$5.SIGNAL_4
  Bottom 0.203: 10.94,22.69 | 10.94,22.69 v10.94,22.87 | U$8.SIGNAL_2 10.94,22.41 10.94,22.69
N$6  (via drill 1)  (2 unrouted)
  other vias: 37.39,19.61 38.65,19.61 39.9,19.61
N$7  (via drill 0.2)
  Top 0.203: U$7.POWER_1 U$1.POWER_3
  other vias: 15.96,24.51
N$8  (via drill 0.2)
  Top 0.203: v15.37,24.05 U$1.SIGNAL_3
  Bottom 0.203: U$7.SIGNAL_1 v15.37,24.05
N$9  (via drill 0.2)
  Top 0.203: U$1.SIGNAL_4 14.86,24.54 v14.86,23.95
  Bottom 0.203: v14.86,23.95 14.86,24.13 | 14.86,24.13 | 14.86,24.13 14.86,24.41 U$7.SIGNAL_2
N$10
  Top 0.152: U$21.46-DVDD
  Top 0.203: C36.1 17.68,16.48 16.32,16.48 16.15,16.32 16.15,15.65 arc90 16.7,15.12 U$21.46-DVDD
N$11  (via drill 0.2)
  Top 0.203: U$1.POWER_4 U$7.POWER_2
  other vias: 14.36,24.51
N$12
  Top 0.203: C34.1 7.96,15.14 U$21.15-AVDD
N$13
  Top 0.089: 17.68,10.64 U$21.37-VCP_LSD
  Top 0.203: 17.68,10.64 17.73,10.64 18.37,10 19.53,10 19.64,10.12 19.64,10.33 C38.1
N$14
  Top 0.089: C31.2 19.52,13.45 18.11,13.45 17.79,13.13 U$21.42-CP1L
N$15  (via drill 0.2)
  Top 0.203: U$5.POWER_1 U$8.POWER_3
  other vias: 9.84,24.51
N$16
  Top 0.089: C31.1 19.24,14.87 19.24,13.71 19.16,13.63 U$21.43-CP1H
N$17  (via drill 0.2)
  Top 0.203: v10.44,24.05 U$5.SIGNAL_1
  Bottom 0.203: U$8.SIGNAL_3 v10.44,24.05
N$18  (via drill 0.2)
  Top 0.203: U$5.SIGNAL_2 10.94,24.54 v10.94,23.96
  Bottom 0.203: v10.94,23.96 10.94,24.13 | 10.94,24.13 | 10.94,24.13 10.94,24.41 U$8.SIGNAL_4
N$19  (via drill 0.2)
  Top 0.203: U$8.POWER_4 U$5.POWER_2
  other vias: 11.44,24.51
N$20
  Top 0.089: C32.2 18.04,12.45 17.73,12.14 U$21.40-CP2L
N$21
  Top 0.089: C32.1 18.18,11.51 18.05,11.64 U$21.39-CP2H
N$22
  Top 0.089: 17.34,14.14 U$21.44-VDRAIN
  Top 0.203: R13.1 18.54,14.14 17.34,14.14
N$23  (via drill 0.2)
  Bottom 0.203: C14.2 17.5,11.5 U$21.38-VCPH
  other vias: 17.15,11.14
N$24
  Bottom 0.089: U2.2 14.4,10.11 14.66,9.85 15.77,9.85 U$10.2 16.83,9.18 16.83,10.31 18.12,11.61 C1.1
N$25  (via drill 0.2)
  Bottom 0.203: U$1.POWER_1 U$7.POWER_3
  other vias: 15.96,22.29
N$26  (via drill 0.2)
  Top 0.203: U$1.SIGNAL_1 v15.37,22.77
  Bottom 0.203: v15.37,22.77 U$7.SIGNAL_3
N$27  (via drill 0.2)
  Top 0.203: v14.86,22.87 14.86,22.29 U$1.SIGNAL_2
  Bottom 0.203: 14.86,22.69 | 14.86,22.69 v14.86,22.87 | U$7.SIGNAL_4 14.86,22.41 14.86,22.69
N$28  (via drill 0.2)
  Bottom 0.203: U$7.POWER_4 U$1.POWER_2
  other vias: 14.36,22.29
N$29  (via drill 1)  (2 unrouted)
  other vias: 42.9,19.61 44.16,19.61 45.42,19.61
N$30  (1 unrouted)
N$31  (1 unrouted)
N$32  (1 unrouted)
N$33  (1 unrouted)
N$34  (1 unrouted)
N$35  (1 unrouted)
N$36  (1 unrouted)
N$37  (via drill 1)  (2 unrouted)
  other vias: 6.16,19.61 7.42,19.61 8.67,19.61
N$38  (1 unrouted)
N$39  (1 unrouted)
N$43  (via drill 1)  (2 unrouted)
  other vias: 11.67,19.61 12.93,19.61 14.19,19.61
N$45  (via drill 0.2)
  Route2 0.152: v7.29,12.38 8.29,12.38 9.32,11.35 9.84,11.35 10.07,11.12 10.07,10.79 10.05,10.78 v10.05,10.62
  Bottom 0.089: C3.2 7.37,12.38 v7.29,12.38
  Bottom 0.152: U2.6 12.4,10.83 12.09,11.15 10.62,11.15 10.57,11.11 10.54,11.11 v10.05,10.62
  Bottom 0.203: R1.2 C3.2
N$47  (via drill 1)  (2 unrouted)
  other vias: 17.18,19.61 18.44,19.61 19.7,19.61
N$53  (via drill 0.2)
  Top 0.089: v15.72,6.61 16.62,5.71 v17.18,5.71
  Bottom 0.089: C2.2 13.36,5.17 | 13.36,5.17 13.76,5.57 | v15.72,6.61 15.67,6.65 14.79,6.65 14.58,6.86 14.58,7.16 14.72,7.3 14.72,7.61 14.51,7.82 13.9,7.82 13.28,8.43 13.28,8.73 13.9,9.35 U2.3 | v17.18,5.71 17.06,5.71 U$10.1 14.79,5.29 14.72,5.22 14.72,5.06 14.51,4.85 13.68,4.85 13.36,5.17
N$81
  Top 0.089: LED9.C 5.98,17.31 R24.2
NFAULT  (via drill 0.2)
  Top 0.089: 12.15,17.05 | 12.15,17.05 U$21.8-NFAULT | v12.97,16.29 12.82,16.45 12.82,16.49 12.55,16.76 12.44,16.76 12.15,17.05
  Bottom 0.089: U2.23 | U2.23 v12.97,16.29 | U2.23 12.9,15.73 12.82,15.65 10.73,15.65 9.91,16.47 R12.1
NFAULT_  (1 unrouted)
NRST  (via drill 0.2)  (1 unrouted)
  Route15 0.089: U2.4 10.36,13.53 10.36,14.98 10.56,15.18 10.56,15.62 10.24,15.94 7.59,15.94 7.39,15.74 5.84,15.74 5.74,15.83 v5.48,15.83
  Bottom 0.089: v5.48,15.83 v5.48,15.82 U$2.POWER_2
  other vias: 13.4,10.49
PWRGD
  Top 0.089: 8.61,16.1 U$21.13-PWRGD
SCL  (via drill 0.2)
  Route15 0.089: U2.33 13.79,12.89 9.67,17.01 9.67,17.44 9.46,17.65 9.16,17.65 8.94,17.43 v8.48,17.43
  Bottom 0.089: U2.33 | v8.48,17.43 8.48,17.17 8.41,17.1 8.41,16.93 8.18,16.7 U$2.SIGNAL_3
  other vias: 15.8,12.89
SCLK  (via drill 0.2)
  Top 0.089: v10.14,17.66 v10.14,17.65 U$21.12-SCLK
  Route15 0.089: U2.30 13.15,14.39 10.14,17.4 v10.14,17.66
  other vias: 15.8,14.39
SDA  (via drill 0.2)
  Route15 0.089: U2.34 14.65,12.39 | 14.64,12.38 14.65,12.39 | 14.65,12.39 13.79,12.39 10.73,15.44 10.73,15.7 9.31,17.12 v9.31,17.29
  Bottom 0.089: 7.84,16.28 U$2.SIGNAL_4 8.31,16.3 8.59,16.57 8.59,17.03 8.67,17.11 9.13,17.11 v9.31,17.29
  other vias: 15.8,12.39
SDI  (via drill 0.2)
  Route15 0.089: v16.02,13.39 16.02,13.59 16.34,13.91 16.34,14.61 16.03,14.92 15.58,14.92 15.4,14.74 13.3,14.74 11.15,16.89 U$21.10-SDI
  Bottom 0.089: U2.32 v16.02,13.39
  other vias: 11.15,17.64
SDO  (via drill 0.2)
  Top 0.089: v10.64,17.64 U$21.11-SDO
  Route15 0.089: v15.8,13.88 15.95,14.03 16.16,14.24 16.16,14.54 15.95,14.75 15.65,14.75 15.47,14.56 13.22,14.56 10.64,17.14 v10.64,17.64
  Bottom 0.089: U2.31 v15.8,13.88
SH_A_  (1 unrouted)
SH_ABOT_3  (via drill 0.2)
  Top 0.089: U$21.35-SH_A 15.15,8.19 15.15,8.18 13.21,8.18 10.96,8.18 10.59,7.81 10.59,7.6 U$9.SIGNAL_1 10.44,6.99 v10.36,6.9 | v7.97,7.18 7.97,8.07 0018.2
  Route2 0.089: v10.36,6.9 8.24,6.9 v7.97,7.18
SH_ATOP_2  (via drill 0.2, 0.45, 1)
  Top 0.089: v9.66,31.66 9.49,31.66
  Bottom 0.089: U$3.SIGNAL_2 10.34,31.2 10.34,31.39 10.26,31.47 9.85,31.47 v9.66,31.66
  other vias: 6.22,36.61 5.64,36.61 5.64,36.03 6.22,36.03 6.81,36.61 6.81,36.03 7.39,36.61 7.39,36.03 7.98,36.03 7.98,36.61 8.56,36.61 8.56,36.03 6.22,37.2 5.64,37.2 6.81,37.2 7.39,37.2 7.98,37.2 8.56,37.2 6.16,43.27 7.42,43.27 8.67,43.27
  pour Bottom (no thermals): 5.14,35.74 5.14,43.27 9.92,43.27 9.92,35.74
  pour Top (no thermals): 9.97,30.76 9.97,37.53 7.06,37.53 5.3,37.53 5.3,35.76 5.3,30.76
SH_B_  (1 unrouted)
SH_BBOT_3  (via drill 0.2)
  Top 0.089: 12.65,8.72 U$21.30-SH_B v12.65,8.54 | v10.87,7.01 10.87,7.43 U$9.SIGNAL_2
  Route2 0.089: v12.65,8.54 11.12,7.01 v10.87,7.01
  Bottom 0.089: v10.87,7.01 10.72,6.87 10.72,6.75 10.49,6.52 8.45,6.52 8.33,6.64 8.33,7.33 0020.2
SH_BTOP_2  (via drill 0.2, 0.45, 1)
  Top 0.089: v10.88,31.55 11.04,31.7
  Bottom 0.089: U$3.SIGNAL_1 10.89,31.54 v10.88,31.55
  other vias: 10.44,36.03 10.44,36.61 11.02,36.61 11.61,36.61 12.19,36.61 12.78,36.61 13.36,36.61 13.94,36.61 13.94,36.03 11.02,36.03 11.61,36.03 12.19,36.03 12.78,36.03 13.36,36.03 10.44,37.2 11.02,37.2 11.61,37.2 12.19,37.2 12.78,37.2 13.36,37.2 13.94,37.2 11.67,43.27 12.93,43.27 14.19,43.27
  pour Bottom (no thermals): 10.1,35.74 10.1,43.27 15.14,43.27 15.14,35.74
  pour Top (rank 2, no thermals): 15.19,30.76 15.19,37.53 12.57,37.53 10.1,37.53 10.1,36.07 10.1,30.76
SH_C_  (1 unrouted)
SH_CBOT_3  (via drill 0.2)
  Top 0.089: v14.94,7.01 14.96,7.04 U$4.SIGNAL_4 | v11.15,9.67 U$21.27-SH_C | v18.13,9.26 0016.2
  Top 0.203: U$21.27-SH_C
  Route2 0.089: v14.94,7.01 14.94,7.91 15.3,8.27 15.3,8.81 14.92,9.2 12.38,9.2 12.3,9.11 11.72,9.11 v11.15,9.67
  Bottom 0.089: v18.13,9.26 17.77,8.9 17.77,8.28 16.5,7.01 v14.94,7.01
SH_CTOP_1  (via drill 0.2, 0.45, 1)
  Bottom 0.089: U$6.SIGNAL_2 15.11,31.18 15.11,31.4 15.48,31.76 16.05,31.76 v16.23,31.95
  other vias: 15.66,36.03 15.66,36.61 16.24,36.61 16.83,36.61 17.41,36.61 18,36.61 18.58,36.61 19.16,36.61 19.16,36.03 18.58,36.03 18,36.03 17.41,36.03 16.83,36.03 16.24,36.03 15.66,37.2 16.24,37.2 16.83,37.2 17.41,37.2 18,37.2 18.58,37.2 19.16,37.2 17.18,43.27 18.44,43.27 19.7,43.27
  pour Bottom (no thermals): 15.32,35.74 15.32,43.27 20.69,43.27 20.69,35.74
  pour Top (no thermals): 20.41,30.76 20.41,37.53 15.49,37.53 15.32,37.53 15.32,37.33 15.32,30.76
SL_A_  (3 unrouted)
SL_ABOT_3  (via drill 0.2)
  Top 0.089: U$9.SIGNAL_3 10.42,5.23 v10.42,5.65 10.06,6.01 9.57,6.01 8.56,7.03 8.56,8.89 9.68,10.01 v9.68,10.96 9.49,11.14 U$21.23-SN1
  Top 0.203: U$21.34-SL_A v14.65,8.55 v14.65,8.54
  Route2 0.089: v14.65,8.54 14.51,8.4 14.51,8.39 14.22,8.11 14.09,8.11 13.87,7.89 12.66,7.89 11.52,6.74 11.13,6.36 v10.42,5.65
  Bottom 0.089: C42.1 9.68,10.23 v9.68,10.96
SL_ATOP_2  (via drill 0.45)  (4 unrouted)
  Top 0.61: v8.33,29.08 8.32,29.07 8.32,28.52
  Bottom 0.203: U$3.SIGNAL_4 10.49,28.56 10.28,28.35 6.76,28.35 0014.2
  other vias: 6.01,28.5 6.01,29.08 6.59,28.5 6.59,29.08 7.18,29.08 7.18,28.5 7.76,28.5 7.76,29.08 8.34,28.5 6.01,29.67 6.59,29.67 7.18,29.67 7.76,29.67 8.34,29.67 6.01,30.25 6.59,30.25 7.18,30.25 7.76,30.25 8.34,30.25
  pour Bottom (no thermals): 8.67,30.58 8.67,28.08 5.17,28.08 5.17,30.58
SL_B_  (1 unrouted)
SL_BOT_3
  Top 0.089: U$9.SIGNAL_4 10.78,5.27 10.78,5.8 10.39,6.19 9.65,6.19 8.96,6.87 8.73,7.1 8.73,8.82 9.95,10.03 11.19,10.03 11.72,10.57 12.02,10.57 12.23,10.36 12.23,10.18 12.39,10.02 12.85,10.02 13.03,9.84 13.21,9.84 13.21,9.2 U$21.31-SL_B
SL_C_  (3 unrouted)
SL_C_2<2  (via drill 0.2)
  Top 0.089: U$21.26-SL_C 10.65,9.73 10.64,9.74 v10.64,8.55 v10.64,8.54 | v8.65,13.14 U$21.19-SN3 8.06,13.14 | U$4.SIGNAL_1 15.36,5.67 v15.32,5.72
  Route2 0.089: U$21.19-SN3 v8.65,13.14
  Route15 0.089: v15.32,5.72 15.12,5.72 14.98,5.58 14.44,5.58 12.01,8 11.42,8 10.88,8.54 v10.64,8.54 8.9,10.28 8.5,10.28 8.28,10.5 8.28,12.79 8.49,13 8.5,13 v8.65,13.14
  Bottom 0.089: C44.1 8.65,13.8 v8.65,13.14
SL_CTOP_1  (via drill 0.45)  (3 unrouted)
  Bottom 0.203: U$6.SIGNAL_3 15.36,28.33 19.1,28.33 0015.2
  other vias: 16.87,29.07 17.45,29.07 18.03,29.07 18.62,29.07 19.2,29.07 18.62,28.49 19.2,28.49 17.45,28.49 18.03,28.49 16.87,28.49 16.87,29.65 17.45,29.65 18.03,29.65 18.62,29.65 19.2,29.65 16.87,30.24 17.45,30.24 18.03,30.24 18.62,30.24 19.2,30.24
  pour Bottom (no thermals): 16.54,30.57 20.69,30.57 20.69,29.43 20.69,28.08 16.6,28.08 16.54,28.08
SO1  (via drill 0.2)
  Top 0.089: v10,14.4 9.51,14.4 9.26,14.66 8.66,14.66 U$21.16-SO1
  Bottom 0.089: v10,14.4 U2.16
SO3  (via drill 0.2)
  Top 0.089: v10,12.38 9.85,12.52 9.63,12.73 9.63,13.24 9.23,13.64 U$21.18-SO3
  Bottom 0.089: v10,12.38 U2.12
SP_A_  (2 unrouted)
SP_ABOT_3  (via drill 0.2)
  Top 0.089: 14.94,5.18 U$4.SIGNAL_2 14.96,5.56 14.96,5.57 14.96,5.8 v14.83,5.94
  Route15 0.089: U$21.24-SP1 9.06,10.64 11.29,8.42 11.29,8.39 11.5,8.18 12.09,8.18 14.33,5.94 v14.83,5.94
  Bottom 0.089: C42.2 8.65,10.89 U$21.24-SP1
  other vias: 8.65,10.64
SP_C_  (2 unrouted)
SP_CBOT_3  (via drill 0.2)
  Top 0.089: U$21.20-SP3 v8.64,12.64 | U$4.SIGNAL_3 15.56,7.27 15.56,7.1 15.69,6.97 15.87,6.97 v16.21,6.62 v16.22,6.62
  Route15 0.089: v16.22,6.62 v16.21,6.62 15.87,6.97 15.57,6.97 15.22,6.62 14.65,6.62 13.01,8.27 13.01,8.69 12.8,8.9 12.21,8.9 11.51,9.59 11.51,9.82 11.3,10.03 10.85,10.03 10.54,10.34 10.54,10.73 v8.64,12.64
  Bottom 0.089: C44.2 8.64,12.47 v8.64,12.64
SWCLK  (via drill 0.2)
  Route15 0.089: v15.8,15.32 15.77,15.34 15.77,16.44 14.93,17.28 12.5,17.28 12.29,17.49 12.29,17.79 11.96,18.12 | v6.74,16.99 6.4,17.34 6.4,17.66 6.61,17.87 6.91,17.87 7.09,17.69 7.98,17.69 8.26,17.97 8.98,17.97 9.01,18 9.72,18 9.91,18.2 11.86,18.2 11.89,18.16 11.93,18.12 11.96,18.12 | 11.95,18.12 11.96,18.12
  Bottom 0.089: 15.74,15.32 U2.28 | U2.28 | U2.28 v15.8,15.32 | U2.28 | U2.28 v15.8,15.32 | v6.74,16.99 6.05,16.3 U$2.SIGNAL_2
SWDIO  (via drill 0.2)
  Route15 0.089: v15.41,16.29 15.27,16.15 15.27,16.14 14.9,15.77 12.52,15.77 12.01,16.28 12.01,17.79 11.78,18.02 9.99,18.02 9.8,17.83 9.09,17.83 9.05,17.79 8.33,17.79 8.05,17.51 v6.76,17.51
  Bottom 0.089: U2.25 14.04,16.43 14.04,16.73 14.23,16.92 15.07,16.92 15.27,16.72 15.27,16.44 v15.41,16.29 | v6.76,17.51 5.94,16.7 U$2.SIGNAL_1
VA  (via drill 0.2)
  Top 0.089: C45.1 5.86,11.49 0019.2 0018.1 v6.74,10.5
  Route2 0.089: v6.74,10.5 8.28,10.5 8.65,10.13 11.05,10.13 11.13,10.21 v11.87,10.21
  Route15 0.089: v6.74,10.5 8.5,8.74 v8.5,5.05
  Bottom 0.089: v11.87,10.21 11.9,10.24 U2.7 | v8.5,5.05 8.52,5.03 U$31.1
VB
  Bottom 0.089: U2.8 11.4,9.93 11.51,9.82 11.51,9.53 10.89,8.9 9.59,8.9 9.38,8.69 8.27,8.69 8.23,8.73 | 8.51,6.98 8.51,6.93 U$31.3 8.23,7.7 8.23,8.73 | 0020.1 6.38,8.62 6.46,8.62 7.09,9.26 C46.1 7.56,9.28 | 7.56,9.28 0021.2 | 7.56,9.28 7.94,8.9 8.06,8.9 8.23,8.73
VC  (via drill 0.2)
  Top 0.089: v15.8,10.96 16.26,10.49 16.26,10.43 16.52,10.17 v17.2,10.17 | 0016.1 C47.1
  Bottom 0.089: U2.10 15,11.39 15.25,11.14 15.62,11.14 v15.8,10.96 | U$31.4 11.16,6.39 11.15,6.39 11.07,6.31 11.07,5.65 11.28,5.44 12.13,5.44 12.84,6.15 13.88,6.15 14.2,6.47 15.34,6.47 15.57,6.25 15.87,6.25 15.88,6.26 16.37,6.26 16.54,6.43 17.24,6.43 18.32,7.51 18.32,7.98 18.39,8.06 19.17,8.06 19.58,8.47 19.58,8.77 C47.1 20.05,9.53 19.81,9.77 19,9.77 0017.2 17.48,10.45 v17.2,10.17
  other vias: 20.05,9.24
VMOTOR  (via drill 0.2, 1)
  Top 0.089: 16.5,12.58 16.5,12.7 17.09,12.7 U$21.41-PVDD
  Top 0.203: R13.2 18.9,15.96 19.31,16.38 20.59,16.38 20.88,16.66 v21.44,16.66 | U$21.41-PVDD 17.31,12.8 17.97,12.8 18.37,13.19 20.47,13.19 | 20.58,13.19 20.47,13.19 | v18.05,5.98 18.17,6.11 18.93,6.11 19.67,6.85 0001.2 | 20.47,13.19 20.48,13.19 20.63,13.19 20.93,12.89 v21.44,12.89 v21.44,14.15 v21.44,15.4 v21.44,16.66 | v21.44,16.66 v21.44,17.92
  Route2 0.203: v18.05,5.98 19.6,7.53 19.6,13.5 20.24,14.15 v21.44,14.15
  Route15 0.203: U$9.POWER_1 9.84,7.23 9.76,7.15 9.76,6.66 10.11,6.31 10.63,6.31 12.15,4.79 16.86,4.79 v18.05,5.98
  Bottom 0.203: C13.1 20.04,15.21 U$11.2 20.79,16.66 v21.44,16.66 | C13.1 20.94,14.57 21.36,14.15 v21.44,14.15 | C14.1 C13.1
  other vias: 9.84,7.45
VMOTOR1  (via drill 1)  (4 unrouted)
  other vias: 47.16,17.92 47.16,16.66 47.16,15.41 47.16,14.15 47.16,12.89
VMOTOR_  (4 unrouted)
VMOTOR_TOP  (via drill 0.2, 1)
  Route2 0.203: v9.89,30.45 9.89,30.84 9.13,31.6 9.13,37.43 8.79,37.76 4.46,37.76 v4.42,37.81
  Bottom 0.203: U$3.POWER_2 v9.89,30.45
  other vias: 4.42,41.58 4.42,40.32 4.42,39.07 21.44,41.58 21.44,40.32 21.44,39.07 21.44,37.81 4.42,36.55 21.44,36.55
  pour Top (rank 3, no thermals): 4.43,42.38 21.44,42.38 21.44,36.13 21.44,35.8 20.93,35.8 4.42,35.8 4.42,42.38
VMOTOR_TOP1  (via drill 1)
  Bottom 0.203: v4.42,12.89 v4.42,14.15 v4.42,15.4 v4.42,16.66 v4.42,17.92
VMOTOR_TOP2  (via drill 1)  (4 unrouted)
  other vias: 30.14,17.92 30.14,16.66 30.14,15.41 30.14,14.15 30.14,12.89
VV  (via drill 0.2)
  Top 0.089: v19.17,9.08 19.17,8.84 18.91,8.57 18.88,8.57 0002.2 0001.1 18.32,6.81 v18.13,6.81
  Route15 0.089: 14.75,9.37 | v10,11.87 10.71,11.87 13.22,9.37 13.78,9.37 14.75,9.37 | v18.13,6.81 17.3,6.81 14.75,9.37
  Bottom 0.089: 10.37,11.89 U2.11 v10,11.88 v10,11.87 | U$31.6 11.98,5.03 12.92,5.97 13.95,5.97 14.28,6.3 15.27,6.3 15.5,6.07 17.13,6.07 17.87,6.81 v18.13,6.81 | v19.17,9.08 C6.1
WAKE  (via drill 0.2)
  Top 0.089: U$21.47-WAKE
  Route2 0.089: v9.8,14.91 9.93,15.04 10.17,15.04 12.29,17.16 12.29,17.79 12.71,18.22 16.05,18.22 16.31,18.48 16.61,18.48 17.15,17.94 17.15,16.76 17.15,16.65 U$21.47-WAKE
  Bottom 0.089: U2.17 9.82,14.89 v9.8,14.91
  other vias: 17.15,15.64